# EAGLE design CARLA_PCB_v1_0 (EAGLE 9.4.2)
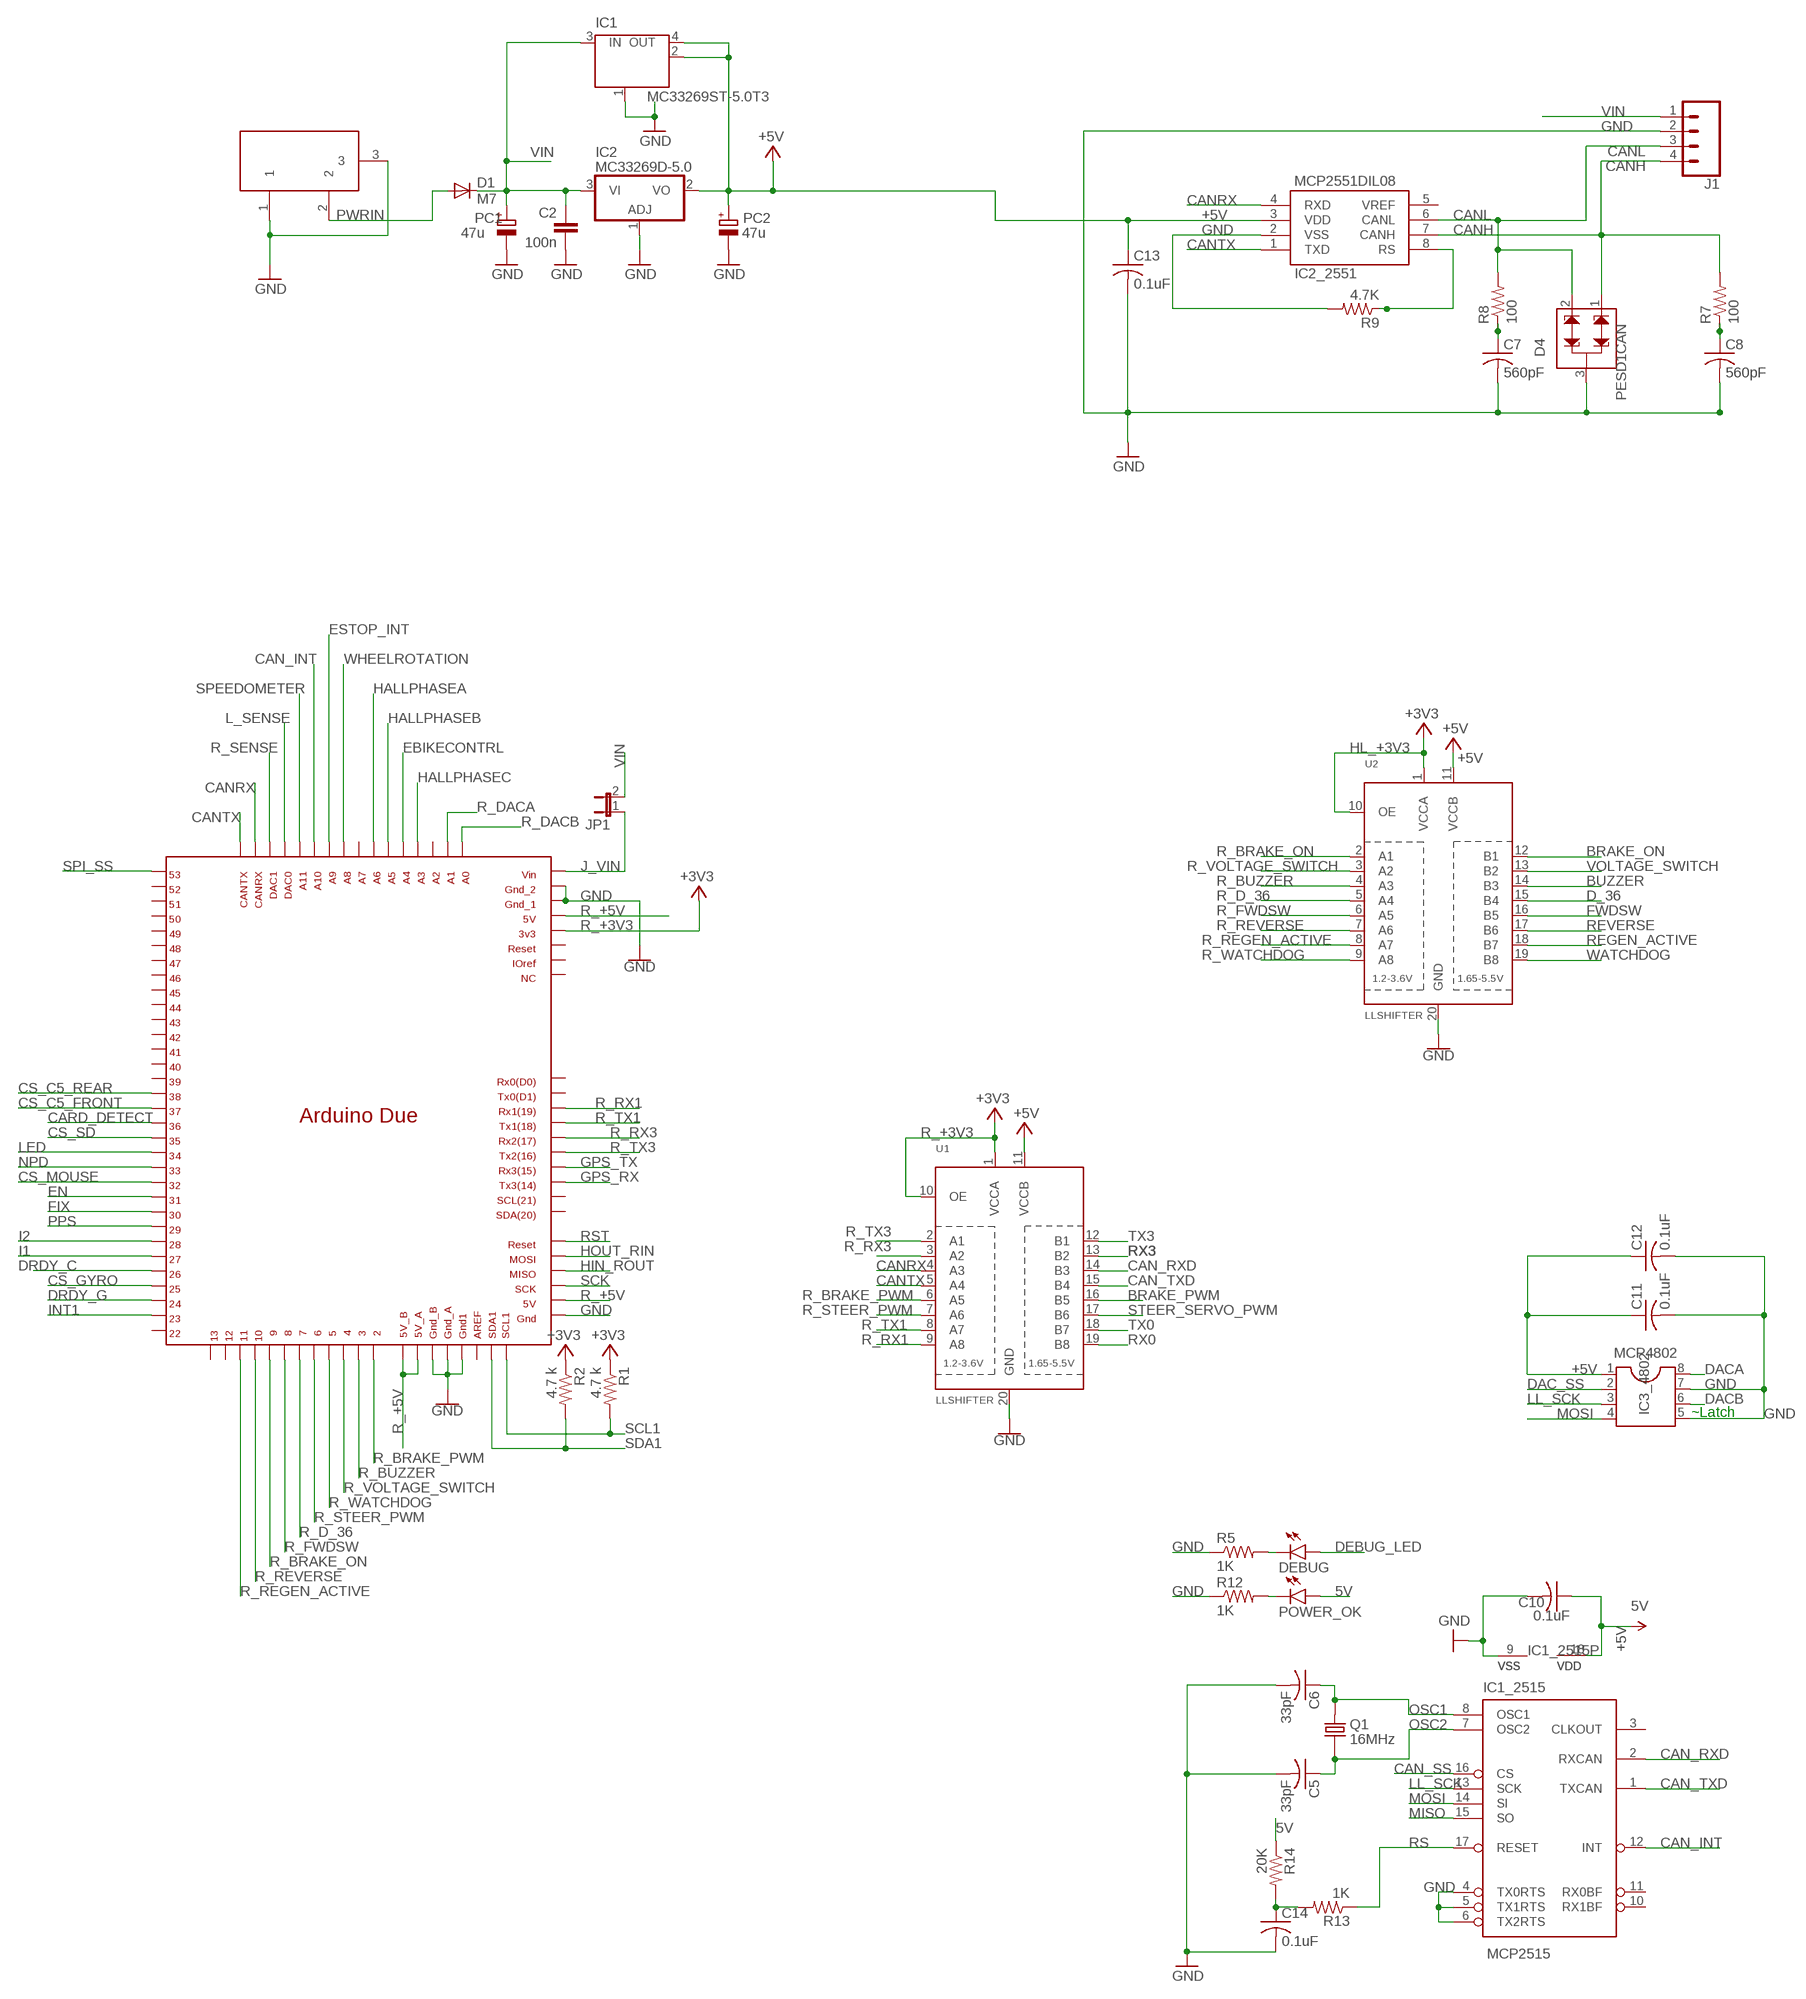
[diagram p0: schematic, sheet 1, part 1 of 2]
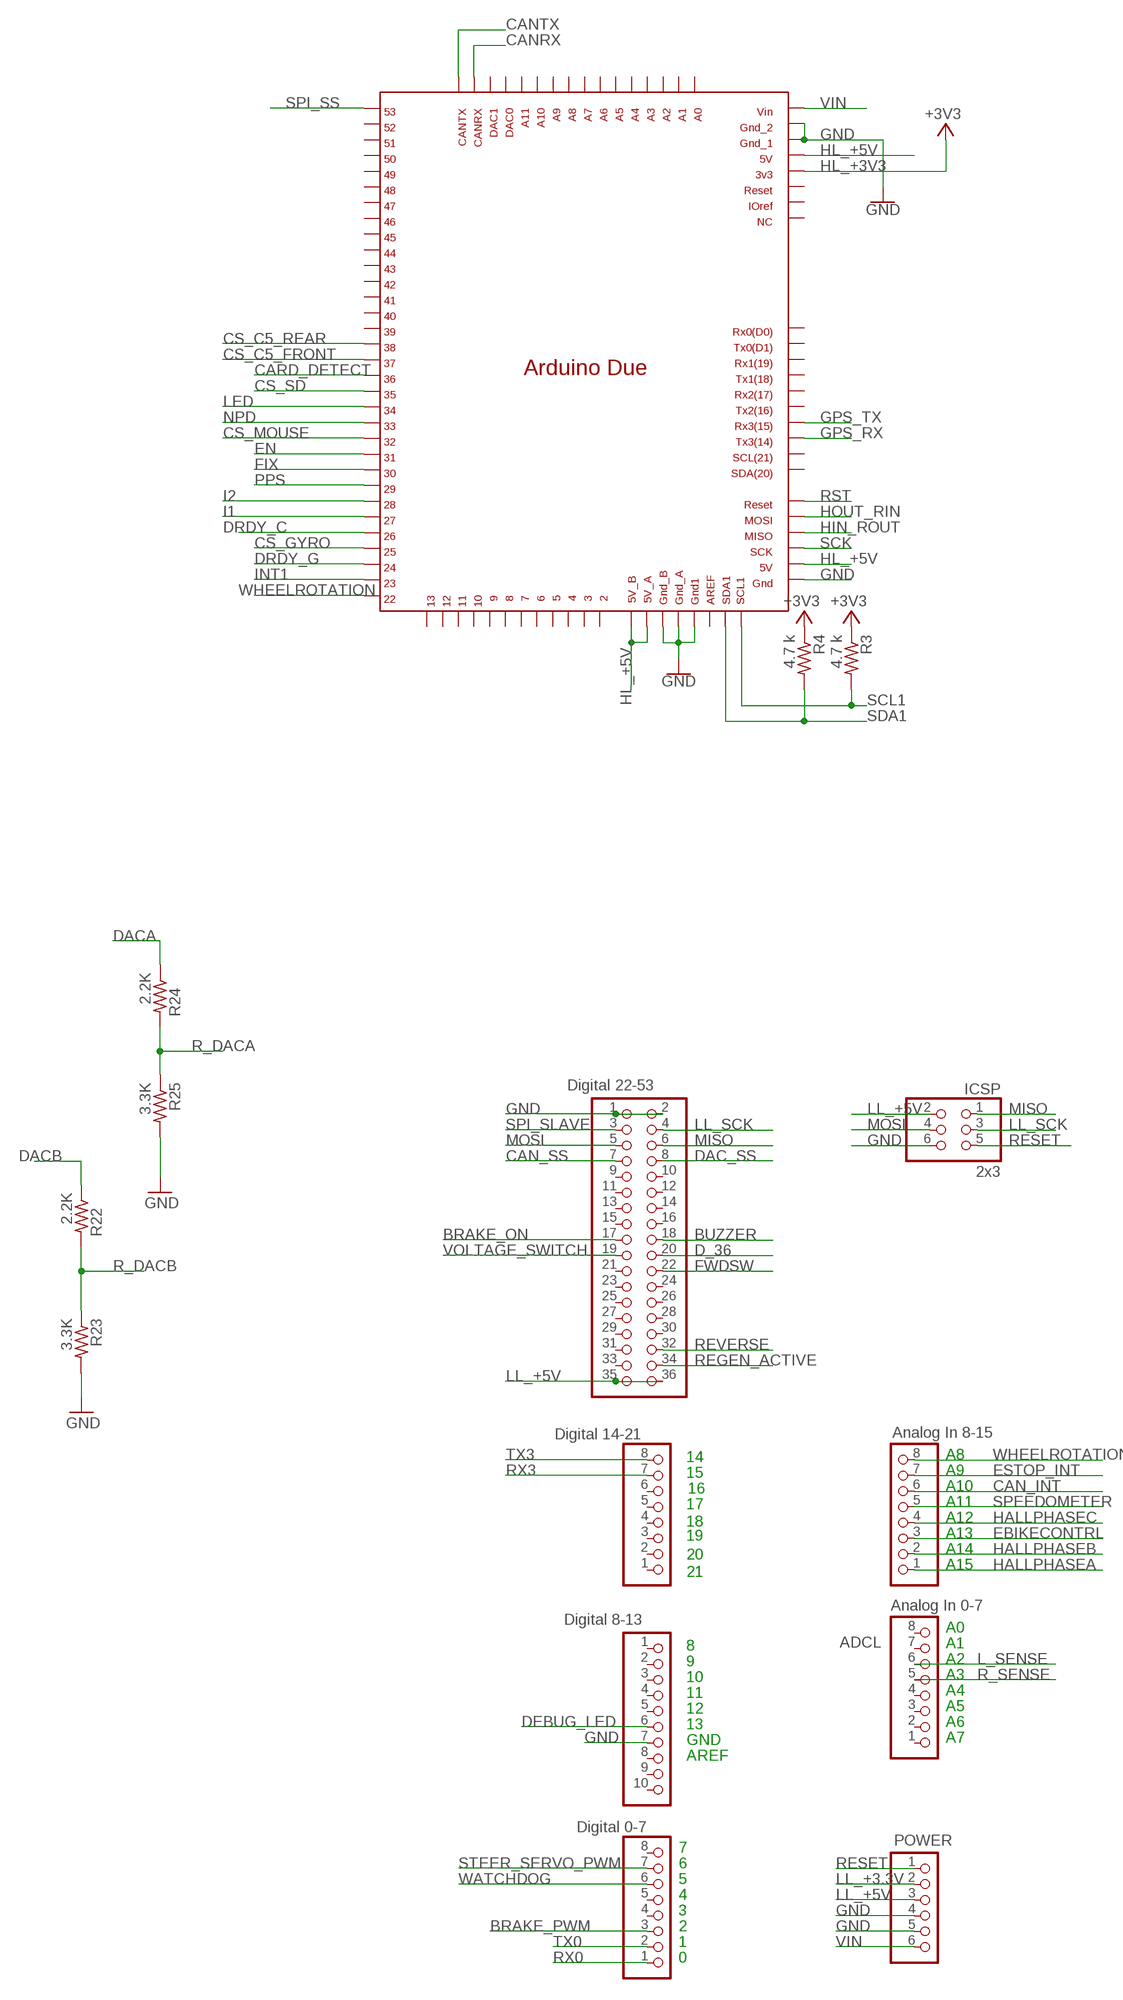
[diagram p1: schematic, sheet 1, part 2 of 2]

## Parts
ADCH  Analog In 8-15  PINHD-1X8  [1X08]
ADCL  Analog In 0-7  PINHD-1X8  [1X08]
C2  100n  C-EU0603-RND  [C0603-ROUND]
C5  33pF  C-USC1206  [C1206]
C6  33pF  C-USC1206  [C1206]
C7  560pF  C-USC1206  [C1206]
C8  560pF  C-USC1206  [C1206]
C10  0.1uF  C-USC1206  [C1206]
C11  0.1uF  C-USC1206  [C1206]
C12  0.1uF  C-USC1206  [C1206]
C13  0.1uF  C-USC1206  [C1206]
C14  0.1uF  C-USC1206  [C1206]
D1  M7  DIODE-SMB  [SMB]
D4  PESD1CAN  [SPARKFUN-DISCRETESEMI_SOT23-3]
DEBUG  LED3MM  [LED3MM]
DIGITAL_0-7  Digital 0-7  PINHD-1X8  [1X08]
DIGITAL_8-13  Digital 8-13  PINHD-1X10  [1X10]
DIGITAL_14-21  Digital 14-21  PINHD-1X8  [1X08]
IC1  MC33269ST-5.0T3  MC33269ST-3.3T3  [SOT223]
IC1_2515  MCP2515  MCP2515(MCP2510)P  [DIP18]
IC2  MC33269D-5.0  [DPACK]
IC2_2551  MCP2551DIL08  [IC-PACKAGE_DIL08]
IC3_4802  MCP4802  DIL8  [DIL08]
ICSP  2x3  PINHD-2X3  [2X03]
J1  CONN_04SCREW  [SCREWTERMINAL-3.5MM-4]
JP1  JP1E  [JP1]
MCU2  DUE(NORMAL)  [DUE(NORMAL)]
MCU3  DUE(NORMAL)  [DUE(NORMAL)]
MEGA_EXPANSION  Digital 22-53  PINHEAD_PINHD-2X18  [PINHEAD_2X18]
PC1  47u  CPOL-EUD  [PANASONIC_D]
PC2  47u  CPOL-EUD  [PANASONIC_D]
POWER  PINHD-1X6  [1X06]
POWER_OK  LED3MM  [LED3MM]
Q1  16MHz  ECS-160-20-46X  [XTAL_ECS-160-20-46X]
R1  4.7 k  R-US_0204/7  [0204/7]
R2  4.7 k  R-US_0204/7  [0204/7]
R3  4.7 k  R-US_0204/7  [0204/7]
R4  4.7 k  R-US_0204/7  [0204/7]
R5  1K  R-US_R1206  [R1206]
R7  100  R-US_R1206  [R1206]
R8  100  R-US_R1206  [R1206]
R9  4.7K  R-US_R1206  [R1206]
R12  1K  R-US_R1206  [R1206]
R13  1K  R-US_R1206  [R1206]
R14  20K  R-US_R1206  [R1206]
R22  2.2K  R-US_R1206  [R1206]
R23  3.3K  R-US_R1206  [R1206]
R24  2.2K  R-US_R1206  [R1206]
R25  3.3K  R-US_R1206  [R1206]
U1  LLSHIFTER  ELSHIFTER  [ELSHIFTER]
U2  LLSHIFTER  ELSHIFTER  [ELSHIFTER]
X1  DC21MMX  [DC-21MM]

## Nets
5V [Power]: POWER_OK.A R14.1
+3V3 [Power]: R1.1 R2.1 R3.1 R4.1
+5V [Power]: C10.1 C11.1 C12.1 C13.1 IC1.2(OUT) IC1.4(OUT) IC1_2515.18(VDD) IC2.2(VO) IC2_2551.3(VDD) IC3_4802.1 PC2.+ U1.11(VCCB) U2.11(VCCB) ; supply symbol labelled 5V
BRAKE_ON: MEGA_EXPANSION.17 U2.12(B1)
BRAKE_PWM: DIGITAL_0-7.3 U1.16(B5)
BUZZER: MEGA_EXPANSION.18 U2.14(B3)
CAN_INT: ADCH.6 IC1_2515.12(INT) MCU2.A10
CAN_RXD: IC1_2515.2(RXCAN) U1.14(B3)
CAN_SS [SPI_Signals]: IC1_2515.16(CS) MEGA_EXPANSION.7
CAN_TXD: IC1_2515.1(TXCAN) U1.15(B4)
CANH: D4.1 IC2_2551.7(CANH) J1.4 R7.2
CANL: D4.2 IC2_2551.6(CANL) J1.3 R8.2
CANRX: IC2_2551.4(RXD) MCU2.CANRX MCU3.CANRX U1.4(A3)
CANTX: IC2_2551.1(TXD) MCU2.CANTX MCU3.CANTX U1.5(A4)
CARD_DETECT: MCU2.36 MCU3.36
CS_C5_FRONT: MCU2.37 MCU3.37
CS_C5_REAR: MCU2.38 MCU3.38
CS_GYRO: MCU2.25 MCU3.25
CS_MOUSE: MCU2.32 MCU3.32
CS_SD: MCU2.35 MCU3.35
D_36: MEGA_EXPANSION.20 U2.15(B4)
DAC_SS [SPI_Signals]: IC3_4802.2 MEGA_EXPANSION.8
DACA: IC3_4802.8 R24.1
DACB: IC3_4802.6 R22.1
DEBUG_LED: DEBUG.A DIGITAL_8-13.6
DRDY_C: MCU2.26 MCU3.26
DRDY_G: MCU2.24 MCU3.24
EBIKECONTRL: ADCH.3 MCU2.A4
EN: MCU2.31 MCU3.31
ESTOP_INT: ADCH.7 MCU2.A9
FIX: MCU2.30 MCU3.30
FWDSW: MEGA_EXPANSION.22 U2.16(B5)
GND: C2.2 C5.2 C6.2 C7.2 C8.2 C10.2 C11.2 C12.2 C13.2 C14.2 D4.3 DIGITAL_8-13.7 IC1.1(GND/ADJ) IC1_2515.4(TX0RTS) IC1_2515.5(TX1RTS) IC1_2515.6(TX2RTS) IC1_2515.9(VSS) IC2.1(ADJ) IC2_2551.2(VSS) IC3_4802.5 IC3_4802.7 ICSP.6 J1.2 MCU2.5V_ICSP MCU2.GND1 MCU2.GND_1 MCU2.GND_2 MCU2.GND_A MCU2.GND_B MCU3.5V_ICSP MCU3.GND1 MCU3.GND_1 MCU3.GND_2 MCU3.GND_A MCU3.GND_B MEGA_EXPANSION.1 MEGA_EXPANSION.2 PC1.- PC2.- POWER.4 POWER.5 R5.1 R9.2 R12.1 R23.2 R25.2 U1.20(GND) U2.20(GND) X1.1 X1.3
GPS_RX: MCU2.TX3 MCU3.TX3
GPS_TX: MCU2.RX3 MCU3.RX3
HALLPHASEA: ADCH.1 MCU2.A6
HALLPHASEB: ADCH.2 MCU2.A5
HALLPHASEC: ADCH.4 MCU2.A3
HIN_ROUT: MCU2.MISO_ICSP MCU3.MISO_ICSP
HL_+3V3 [Power]: MCU3.3V3 U2.1(VCCA) U2.10(OE) ; supply symbol labelled +3V3
HL_+5V [Power]: MCU3.5V MCU3.5V_A MCU3.5V_B MCU3.GND_ICSP
HOUT_RIN: MCU2.MOSI_ICSP MCU3.MOSI_ICSP
I1: MCU2.27 MCU3.27
I2: MCU2.28 MCU3.28
INT1: MCU2.23 MCU3.23
J_VIN [Power]: JP1.1 MCU2.VIN
L_SENSE: ADCL.6 MCU2.DAC0
LED: MCU2.34 MCU3.34
LL_+3.3V [Power]: POWER.2
LL_+5V [Power]: ICSP.2 MEGA_EXPANSION.35 MEGA_EXPANSION.36 POWER.3
LL_SCK: IC1_2515.13(SCK) IC3_4802.3 ICSP.3 MEGA_EXPANSION.4
MISO: IC1_2515.15(SO) ICSP.1 MEGA_EXPANSION.6
MOSI: IC1_2515.14(SI) IC3_4802.4 ICSP.4 MEGA_EXPANSION.5
N$4: C14.1 R13.2 R14.2
N$9: C7.1 R8.1
N$10: C8.1 R7.1
N$12: POWER_OK.K(C) R12.2
N$13: DEBUG.K(C) R5.2
N$14: IC2_2551.8(RS) R9.1
NPD: MCU2.33 MCU3.33
OSC1 [Oscillator]: C6.1 IC1_2515.8(OSC1) Q1.2
OSC2 [Oscillator]: C5.1 IC1_2515.7(OSC2) Q1.1
PPS: MCU2.29 MCU3.29
PWRIN: D1.A X1.2
R_+3V3 [Power]: MCU2.3V3 U1.1(VCCA) U1.10(OE) ; supply symbol labelled +3V3
R_+5V [Power]: MCU2.5V MCU2.5V_A MCU2.5V_B MCU2.GND_ICSP
R_BRAKE_ON: MCU2.9 U2.2(A1)
R_BRAKE_PWM: MCU2.2 U1.6(A5)
R_BUZZER: MCU2.3 U2.4(A3)
R_D_36: MCU2.7 U2.5(A4)
R_DACA: MCU2.A1 R24.2 R25.1
R_DACB: MCU2.A0 R22.2 R23.1
R_FWDSW: MCU2.8 U2.6(A5)
R_REGEN_ACTIVE: MCU2.11 U2.8(A7)
R_REVERSE: MCU2.10 U2.7(A6)
R_RX1: MCU2.RX1 U1.9(A8)
R_RX3: MCU2.RX2 U1.3(A2)
R_SENSE: ADCL.5 MCU2.DAC1
R_STEER_PWM: MCU2.6 U1.7(A6)
R_TX1: MCU2.TX1 U1.8(A7)
R_TX3: MCU2.TX2 U1.2(A1)
R_VOLTAGE_SWITCH: MCU2.4 U2.3(A2)
R_WATCHDOG: MCU2.5 U2.9(A8)
REGEN_ACTIVE: MEGA_EXPANSION.34 U2.18(B7)
RESET: ICSP.5 POWER.1
REVERSE: MEGA_EXPANSION.32 U2.17(B6)
RS: IC1_2515.17(RESET) R13.1
RST: MCU2.RESET_ICSP MCU3.RESET_ICSP
RX0: DIGITAL_0-7.1 U1.19(B8)
RX3: DIGITAL_14-21.7 U1.13(B2)
SCK: MCU2.SCK_ICSP MCU3.SCK_ICSP
SCL1: MCU2.SCL1 MCU3.SCL1 R1.2 R3.2
SDA1: MCU2.SDA1 MCU3.SDA1 R2.2 R4.2
SPEEDOMETER: ADCH.5 MCU2.A11
SPI_SLAVE [SPI_Signals]: MEGA_EXPANSION.3
SPI_SS: MCU2.53 MCU3.53
STEER_SERVO_PWM: DIGITAL_0-7.7 U1.17(B6)
TX0: DIGITAL_0-7.2 U1.18(B7)
TX3: DIGITAL_14-21.8 U1.12(B1)
VIN [Power]: C2.1 D1.C IC1.3(IN) IC2.3(VI) J1.1 JP1.2 MCU3.VIN PC1.+ POWER.6
VOLTAGE_SWITCH: MEGA_EXPANSION.19 U2.13(B2)
WATCHDOG: DIGITAL_0-7.6 U2.19(B8)
WHEELROTATION: ADCH.8 MCU2.A8 MCU3.22
Unconnected: ADCL.1 ADCL.2 ADCL.3 ADCL.4 ADCL.7 ADCL.8 DIGITAL_0-7.4 DIGITAL_0-7.5 DIGITAL_0-7.8 DIGITAL_8-13.1 DIGITAL_8-13.2 DIGITAL_8-13.3 DIGITAL_8-13.4 DIGITAL_8-13.5 DIGITAL_8-13.8 DIGITAL_8-13.9 DIGITAL_8-13.10 DIGITAL_14-21.1 DIGITAL_14-21.2 DIGITAL_14-21.3 DIGITAL_14-21.4 DIGITAL_14-21.5 DIGITAL_14-21.6 IC1_2515.3(CLKOUT) IC1_2515.10(RX1BF) IC1_2515.11(RX0BF) IC2_2551.5(VREF) MCU2.12 MCU2.13 MCU2.22 MCU2.39 MCU2.40 MCU2.41 MCU2.42 MCU2.43 MCU2.44 MCU2.45 MCU2.46 MCU2.47 MCU2.48 MCU2.49 MCU2.50 MCU2.51 MCU2.52 MCU2.A2 MCU2.A7 MCU2.AREF MCU2.IOREF MCU2.NC MCU2.RESET MCU2.RX0 MCU2.SCL MCU2.SDA MCU2.TX0 MCU3.2 MCU3.3 MCU3.4 MCU3.5 MCU3.6 MCU3.7 MCU3.8 MCU3.9 MCU3.10 MCU3.11 MCU3.12 MCU3.13 MCU3.39 MCU3.40 MCU3.41 MCU3.42 MCU3.43 MCU3.44 MCU3.45 MCU3.46 MCU3.47 MCU3.48 MCU3.49 MCU3.50 MCU3.51 MCU3.52 MCU3.A0 MCU3.A1 MCU3.A2 MCU3.A3 MCU3.A4 MCU3.A5 MCU3.A6 MCU3.A7 MCU3.A8 MCU3.A9 MCU3.A10 MCU3.A11 MCU3.AREF MCU3.DAC0 MCU3.DAC1 MCU3.IOREF MCU3.NC MCU3.RESET MCU3.RX0 MCU3.RX1 MCU3.RX2 MCU3.SCL MCU3.SDA MCU3.TX0 MCU3.TX1 MCU3.TX2 MEGA_EXPANSION.9 MEGA_EXPANSION.10 MEGA_EXPANSION.11 MEGA_EXPANSION.12 MEGA_EXPANSION.13 MEGA_EXPANSION.14 MEGA_EXPANSION.15 MEGA_EXPANSION.16 MEGA_EXPANSION.21 MEGA_EXPANSION.23 MEGA_EXPANSION.24 MEGA_EXPANSION.25 MEGA_EXPANSION.26 MEGA_EXPANSION.27 MEGA_EXPANSION.28 MEGA_EXPANSION.29 MEGA_EXPANSION.30 MEGA_EXPANSION.31 MEGA_EXPANSION.33

## Notes on the sheet
- ~Latch
- 14 | A8
- 15 | A9
- 16 | A10
- 17 | A11
- 18 | A12
- 19 | A13
- A14
- 20
- A15
- 21
- A0
- 8 | A1
- 9 | A2
- 10 | A3
- 11 | A4
- 12 | A5
- 13 | A6
- GND | A7
- AREF
- 7
- 6
- 5
- 4
- 3
- 2
- 1
- 0

## Library data of the parts
ADCH ADCL DIGITAL_0-7 DIGITAL_14-21 = pinhead:PINHD-1X8: PIN HEADER
C2 = SmartPrj:C-EU: CAPACITOR, European symbol
C5-C8 C10-C14 = resistor:C-US: CAPACITOR, American symbol
D1 = diode:DIODE-: DIODE
D4 = elcanoParts:PESD1CAN: CAN bus ESD protection diode PESD1CAN is used to protect two CAN bus lines from ESD. Link to datasheet <http://www.nxp.com/documents/data_sheet/PESD1CAN-U.pdf> SparkFun Products: SparkFun CAN-BUS Shield <https://www.sparkfun.com/products/13262> '; SPICEPREFIX: J
DEBUG POWER_OK = led:LED: LED OSRAM: - CHIPLED LG R971, LG N971, LY N971, LG Q971, LY Q971, LO R971, LY R971 LH N974, LH R974 LS Q976, LO Q976, LY Q976 LO Q996 - Hyper CHIPLED LW Q18S LB Q993, LB Q99A, LB R99A - SideLED LS A670, LO A670, LY A670, LG A670, LP A670 LB A673, LV A673, LT A673, LW A673 LH A674 LY A675 LS A676, LA A676, LO A676, LY A676, LW A676 LS A679, LY A679, LG A679 - Hyper Micro SIDELED® LS Y876, LA Y876, LO Y876, LY Y876 LT Y87S - SmartLED LW L88C, LW L88S LB L89C, LB L89S, LG L890 LS L89K, LO L89K, LY L89K LS L896, LA L896, LO L896, LY L896 - TOPLED LS T670, LO T670, LY T670, LG T670, LP T670 LSG T670, LSP T670, LSY T670, LOP T670, LYG T670 LG T671, LOG T671, LSG T671 LB T673, LV T673, LT T673, LW T673 LH T674 LS T676, LA T676, LO T676, LY T676, LB T676, LH T676, LSB T676, LW T676 LB T67C, LV T67C, LT T67C, LS T67K, LO T67K, LY T67K, LW E67C LS E67B, LA E67B, LO E67B, LY E67B, LB E67C, LV E67C, LT E67C LW T67C LS T679, LY T679, LG T679 LS T770, LO T770, LY T770, LG T770, LP T770 LB T773, LV T773, LT T773, LW T773 LH T774 LS E675, LA E675, LY E675, LS T675 LS T776, LA T776, LO T776, LY T776, LB T776 LHGB T686 LT T68C, LB T68C - Hyper Mini TOPLED® LB M676 - Mini TOPLED Santana® LG M470 LS M47K, LO M47K, LY M47K Source: http://www.osram.convergy.de LUXEON: - LUMILED® LXK2-PW12-R00, LXK2-PW12-S00, LXK2-PW14-U00, LXK2-PW14-V00 LXK2-PM12-R00, LXK2-PM12-S00, LXK2-PM14-U00 LXK2-PE12-Q00, LXK2-PE12-R00, LXK2-PE12-S00, LXK2-PE14-T00, LXK2-PE14-U00 LXK2-PB12-K00, LXK2-PB12-L00, LXK2-PB12-M00, LXK2-PB14-N00, LXK2-PB14-P00, LXK2-PB14-Q00 LXK2-PR12-L00, LXK2-PR12-M00, LXK2-PR14-Q00, LXK2-PR14-R00 LXK2-PD12-Q00, LXK2-PD12-R00, LXK2-PD12-S00 LXK2-PH12-R00, LXK2-PH12-S00 LXK2-PL12-P00, LXK2-PL12-Q00, LXK2-PL12-R00 Source: www.luxeon.com KINGBRIGHT: KA-3528ASYC Source: www.kingbright.com
DIGITAL_8-13 = pinhead:PINHD-1X10: PIN HEADER
IC1 = linear:MC33269ST*: Adjustable Output Low Dropout Voltage Regulator 800 mA Source: http://www.onsemi.com/pub/Collateral/MC33269-D.PDF
IC1_2515 = SparkFun-IC-Comms:MCP2515(MCP2510): CAN controller with SPI interface The MCP2515 controller supercedes the MCP2510 while addressing all errata associated with it. The two devices are pin compatible, either can be used with this device. 18-pin package SOIC Simple SPI interface to any MCU. One-shot mode ensures message transmission is attempted only once Databyte filtering Start-of-Frame (SOF) output Low-power CMOS Technology Datasheet <http://www.sparkfun.com/datasheets/DevTools/Arduino/MCP2515.pdf> SparkFun Products CAN-BUS Shield <https://www.sparkfun.com/products/13262> (DEV-13262); PROD_ID: NA-XXXXX; SPICEPREFIX: X
IC2 = linear:MC33269?*: Adjustable Output Low Dropout Voltage Regulator 800 mA Source: http://www.onsemi.com/pub/Collateral/MC33269-D.PDF
IC2_2551 = elcanoParts:MCP2551: CAN transceiver; SPICEPREFIX: X
IC3_4802 = ic-package:DIL8: Dual In Line / Socket
ICSP = pinhead:PINHD-2X3: PIN HEADER
J1 = SparkFun-Connectors:CONN_04: Multi connection point. Often used as Generic Header-pin footprint for 0.1 inch spaced/style header connections On any of the 0.1 inch spaced packages, you can populate with these: Break Away Headers - Straight <https://www.sparkfun.com/products/116> (PRT-00116) Break Away Male Headers - Right Angle <https://www.sparkfun.com/products/553> (PRT-00553) Female Headers <https://www.sparkfun.com/products/115> (PRT-00115) Break Away Headers - Machine Pin <https://www.sparkfun.com/products/117> (PRT-00117) Break Away Female Headers - Swiss Machine Pin <https://www.sparkfun.com/products/743> (PRT-00743) For SCREWTERMINALS and SPRING TERMINALS visit here: Screw Terimnals on SparkFun.com <https://www.sparkfun.com/search/results?term=Screw+Terminals> (5mm/3.5mm/2.54mm spacing) This device is also useful as a general connection point to wire up your design to another part of your project. Our various solder wires solder well into these plated through hole pads. Hook-Up Wire - Assortment (Stranded, 22 AWG) <https://www.sparkfun.com/products/11375> (PRT-11375) Hook-Up Wire - Assortment (Solid Core, 22 AWG) <https://www.sparkfun.com/products/11367> (PRT-11367) View the entire wire category on our website here <https://www.sparkfun.com/categories/141> Special notes: Molex polarized connector foot print use with SKU : PRT-08231 with associated crimp pins and housings. 1MM SMD Version SKU: PRT-10208; PROD_ID: 2xCONN-08399; SF_ID: 2xPRT-08084
JP1 = jumper:JP1E: JUMPER
MCU2 MCU3 = DUElib130425:DUE(NORMAL)
MEGA_EXPANSION = elcanoParts:PINHEAD_PINHD-2X18: PIN HEADER
PC1 PC2 = rcl:CPOL-EU: POLARIZED CAPACITOR, European symbol
POWER = pinhead:PINHD-1X6: PIN HEADER
Q1 = elcanoParts:ECS-160-20-46X: QUARTZ CRYSTAL T/H; DESCRIPTION: Crystal 16MHz ±30ppm _Tol_ ±50ppm _Stability_ 20pF FUND 50Ohm; DIGI-KEY_PART_NUMBER: XC1759-ND; DIGI-KEY_PURCHASE_URL: https://www.digikey.com/product-detail/en/ecs-inc/ECS-160-20-46X/XC1759-ND/2676589?utm_source=snapeda&utm_medium=aggregator&utm_campaign=symbol; MF: ECS Inc.; MP: ECS-160-20-46X; PACKAGE: HC46/X ECS International; SPICEPREFIX: B
R1-R5 R7-R9 R12-R14 R22-R25 = resistor:R-US_: RESISTOR, American symbol
U1 U2 = ELCano_Footprints:ELSHIFTER: TXB0108 LEVEL SHIFTER. Foot Print for adafruit breakout board.
X1 = powersupply:DC21MM

## Net classes
0 default: width 0.254 mm, drill 0.305 mm, clearance 0.254 mm
1 Power: width 0.508 mm, drill 0.305 mm, clearance 0.254 mm
3 SPI_Signals: width 0.254 mm, clearance 0.254 mm
4 Oscillator: width 0.254 mm, clearance 0.508 mm

## Board
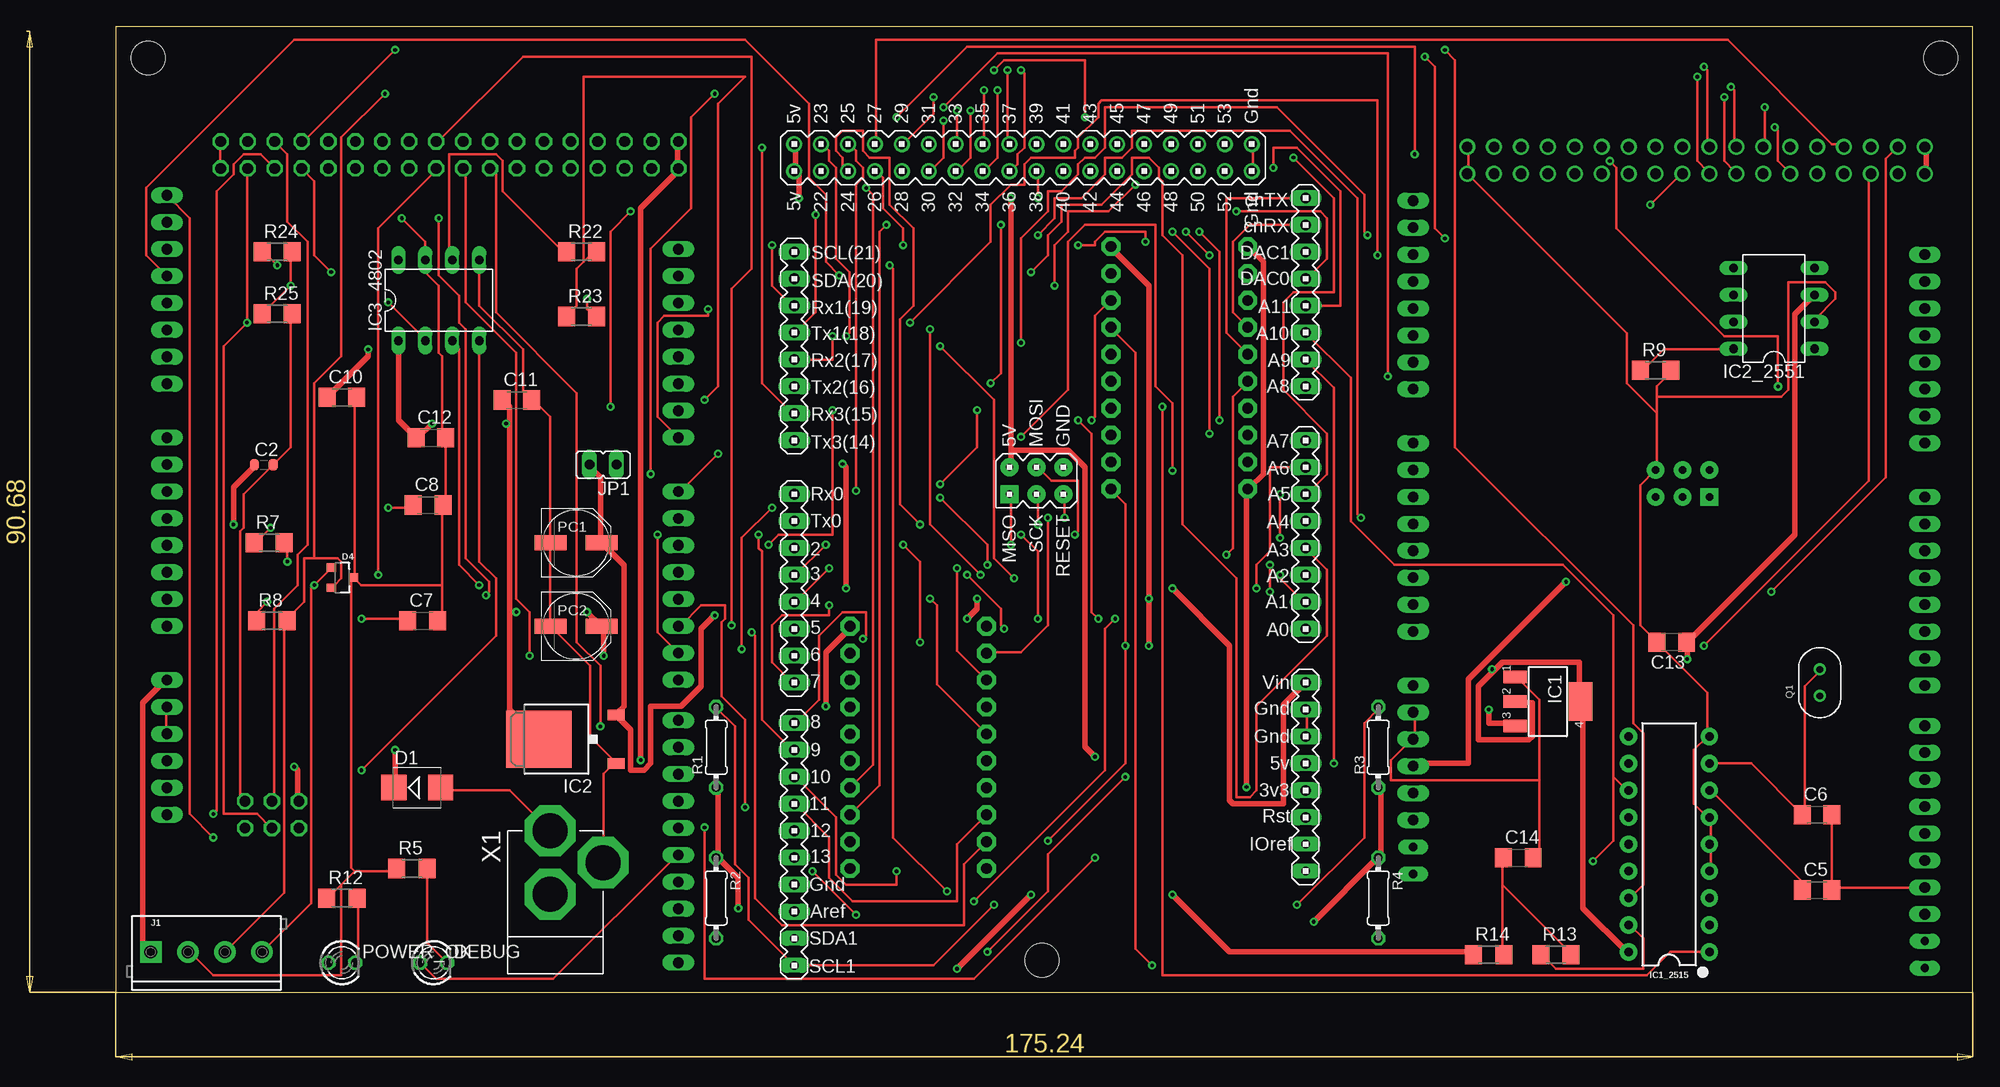
[diagram p2: board, top side]
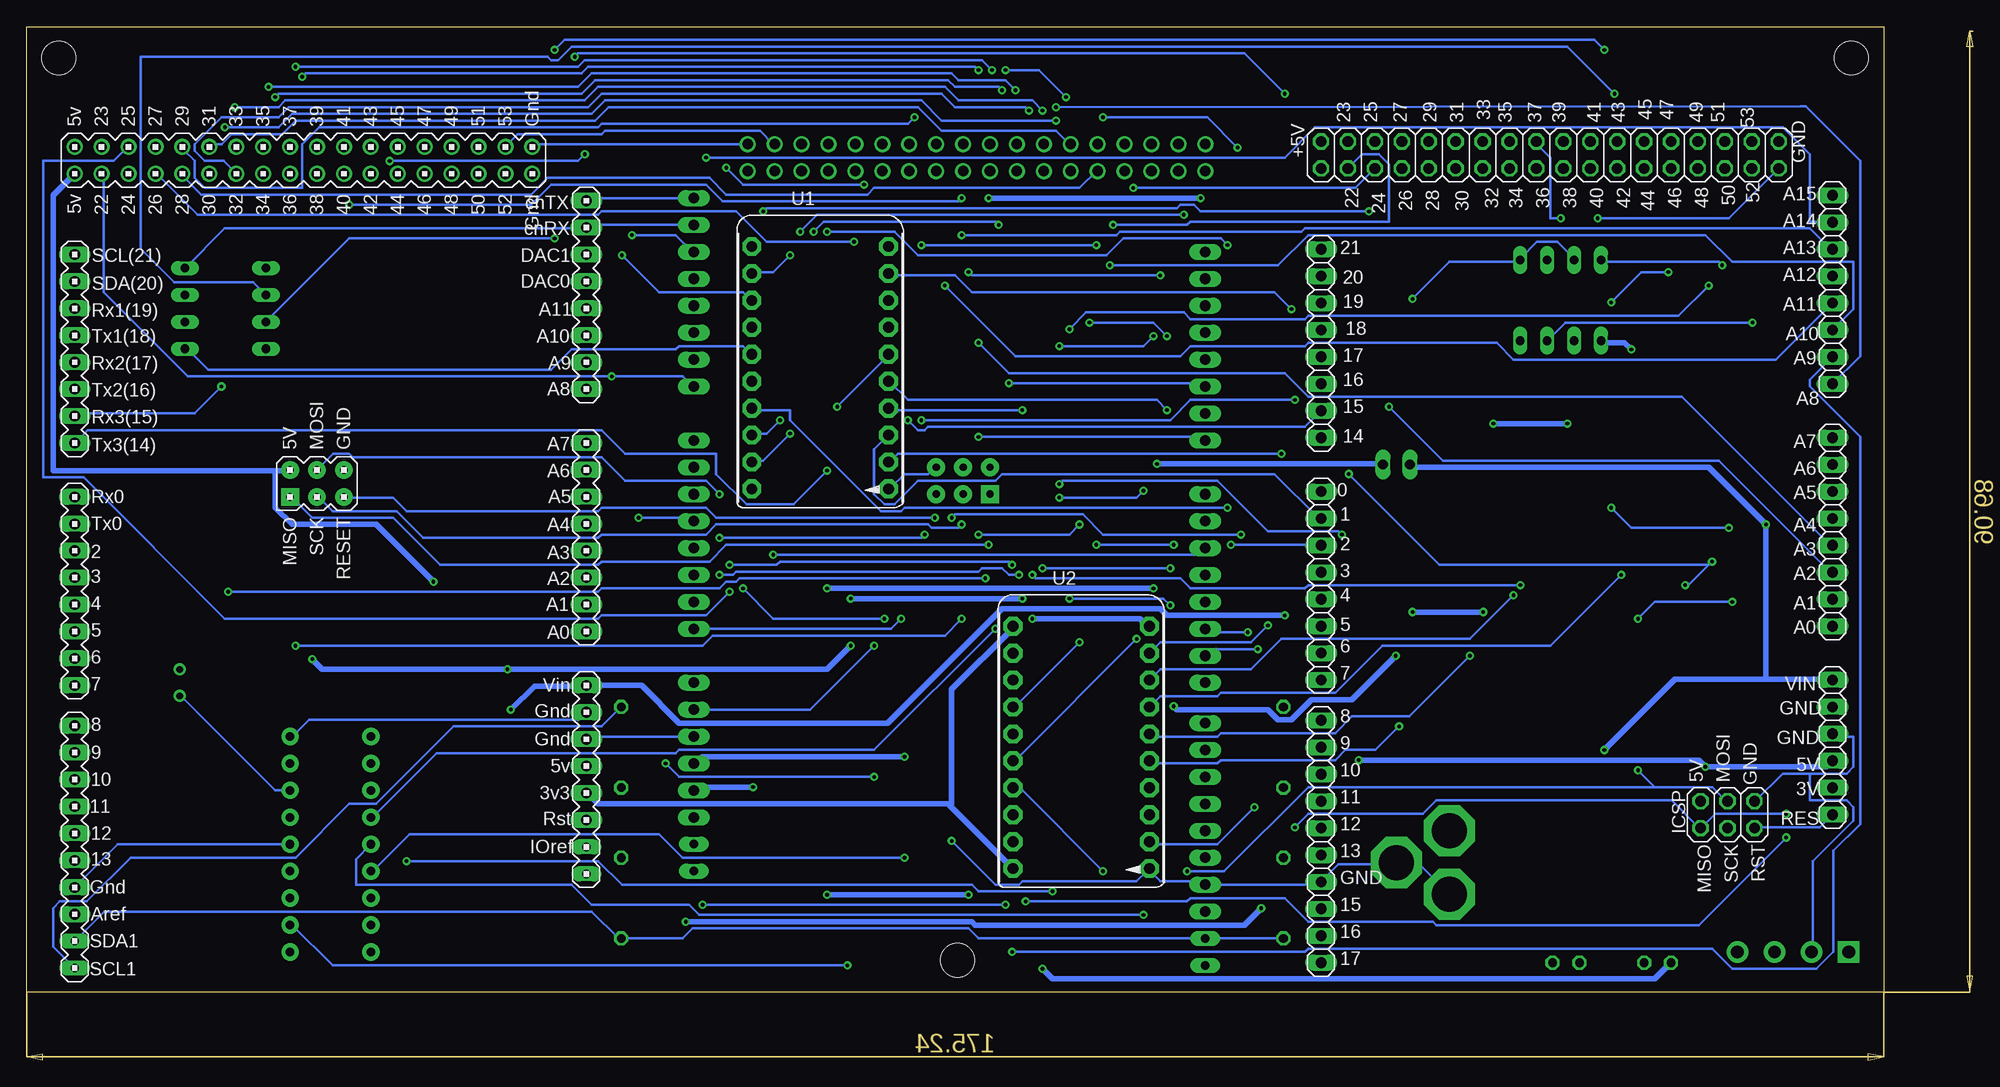
[diagram p3: board, bottom side, seen from below]

Size 175.24 x 91.11 mm. Coordinates in mm from the lower left corner, seen from the top.
Outline: 0,0 175.24,0 175.24,91.11 0,91.11 0,0
Copper layers (1*16): Top 0.035mm / dielectric 1.5mm / Bottom 0.035mm
Design rules "default": minimum track width 6mil, minimum drill 0.35mm, track to track 6mil, track to pad 6mil, pad to pad 6mil, via to via 6mil, smd to smd 6mil, copper to edge 40mil, drill to drill 6mil, minimum pad ring 10mil, minimum via ring 8mil, stop-mask expansion 4mil, vias tented up to drill 0mil, thermal gap 10mil
Holes 3.2 mm at 3.05,88.14 172.21,88.14 87.38,3.05

### Footprints (pad centres in the part's own frame; a part is rotated, then mirrored left to right if it is on the bottom)
1X08 = drill 1.016 long: 1 -8.89,0; 2 -6.35,0; 3 -3.81,0; 4 -1.27,0; 5 1.27,0; 6 3.81,0; 7 6.35,0; 8 8.89,0
C0603-ROUND = smd 0.898 x 1.1: 1 -0.889,0; 2 0.889,0
C1206 = smd 1.6 x 1.8: 1 -1.4,0; 2 1.4,0
SMB = smd 2.4 x 2.4: A 2.2,0; C -2.2,0
SPARKFUN-DISCRETESEMI_SOT23-3 = smd 0.8 x 0.9: 1 -0.95,-1; 2 0.95,-1; 3 0,1.1
LED3MM = drill 0.813 octagon: A -1.27,0; K 1.27,0
1X10 = drill 1.016 long: 1 -11.43,0; 2 -8.89,0; 3 -6.35,0; 4 -3.81,0; 5 -1.27,0; 6 1.27,0; 7 3.81,0; 8 6.35,0; 9 8.89,0; 10 11.43,0
SOT223 = smd 1.219 x 2.235: 1 -2.311,-3.099; 2 0,-3.099; 3 2.311,-3.099 | smd 3.6 x 2.2: 4 0,3.099
DIP18 = drill 0.813 pad 1.626: 1 -10.16,-3.81; 2 -7.62,-3.81; 3 -5.08,-3.81; 4 -2.54,-3.81; 5 0,-3.81; 6 2.54,-3.81; 7 5.08,-3.81; 8 7.62,-3.81; 9 10.16,-3.81; 10 10.16,3.81; 11 7.62,3.81; 12 5.08,3.81; 13 2.54,3.81; 14 0,3.81; 15 -2.54,3.81; 16 -5.08,3.81; 17 -7.62,3.81; 18 -10.16,3.81
DPACK = smd 1 x 1.6: 1 -2.28,-4.8; 3 2.28,-4.8 | smd 5.4 x 6.2: 2 0,2.5
IC-PACKAGE_DIL08 = drill 0.813 long: 1 -3.81,-3.81; 2 -1.27,-3.81; 3 1.27,-3.81; 4 3.81,-3.81; 5 3.81,3.81; 6 1.27,3.81; 7 -1.27,3.81; 8 -3.81,3.81
DIL08 = drill 0.813 long: 1 -3.81,-3.81; 2 -1.27,-3.81; 3 1.27,-3.81; 4 3.81,-3.81; 5 3.81,3.81; 6 1.27,3.81; 7 -1.27,3.81; 8 -3.81,3.81
2X03 = drill 1.016 octagon: 1 -2.54,-1.27; 2 -2.54,1.27; 3 0,-1.27; 4 0,1.27; 5 2.54,-1.27; 6 2.54,1.27
SCREWTERMINAL-3.5MM-4 = drill 1.2 pad 2.032 square: 1 0,0 | drill 1.2 pad 2.032: 2 3.5,0; 3 7,0; 4 10.5,0
JP1 = drill 0.914 long: 1 0,-1.27; 2 0,1.27
DUE(NORMAL) = drill 1 long: 2 -16.51,30.48; 3 -19.05,30.48; 3V3 -39.37,-17.78; 4 -21.59,30.48; 5 -24.13,30.48; 5V -36.83,-17.78; 6 -26.67,30.48; 7 -29.21,30.48; 8 -33.02,30.48; 9 -35.56,30.48; 10 -38.1,30.48; 11 -40.64,30.48; 12 -43.18,30.48; 13 -45.72,30.48; A0 -24.13,-17.78; A1 -21.59,-17.78; A2 -19.05,-17.78; A3 -16.51,-17.78; A4 -13.97,-17.78; A5 -11.43,-17.78; A6 -8.89,-17.78; A7 -6.35,-17.78; A8 -1.27,-17.78; A9 1.27,-17.78; A10 3.81,-17.78; A11 6.35,-17.78; AREF -50.8,30.48; CANRX 13.97,-17.78; CANTX 16.51,-17.78; DAC0 8.89,-17.78; DAC1 11.43,-17.78; GND1 -48.26,30.48; GND_1 -34.29,-17.78; GND_2 -31.75,-17.78; RESET -41.91,-17.78; RX0 -11.43,30.48; RX1 6.35,30.48; RX2 1.27,30.48; RX3 -3.81,30.48; SCL 11.43,30.48; SDA 8.89,30.48; TX0 -13.97,30.48; TX1 3.81,30.48; TX2 -1.27,30.48; TX3 -6.35,30.48; VIN -29.21,-17.78 | drill 1: 5V_A 19.05,30.48; 5V_B 21.59,30.48; 22 19.05,27.94; 23 21.59,27.94; 24 19.05,25.4; 25 21.59,25.4; 26 19.05,22.86; 27 21.59,22.86; 28 19.05,20.32; 29 21.59,20.32; 30 19.05,17.78; 31 21.59,17.78; 32 19.05,15.24; 33 21.59,15.24; 34 19.05,12.7; 35 21.59,12.7; 36 19.05,10.16; 37 21.59,10.16; 38 19.05,7.62; 39 21.59,7.62; 40 19.05,5.08; 41 21.59,5.08; 42 19.05,2.54; 43 21.59,2.54; 44 19.05,0; 45 21.59,0; 46 19.05,-2.54; 47 21.59,-2.54; 48 19.05,-5.08; 49 21.59,-5.08; 50 19.05,-7.62; 51 21.59,-7.62; 52 19.05,-10.16; 53 21.59,-10.16; GND_A 19.05,-12.7; GND_B 21.59,-12.7 | drill 0.7 pad 1.676: 5V_ICSP -8.89,5.08; GND_ICSP -8.89,10.16; MOSI_ICSP -8.89,7.62; RESET_ICSP -11.43,5.08; SCK_ICSP -11.43,7.62 | drill 0.8 pad 1.422 long: IOREF -44.45,-17.78; NC -46.99,-17.78; SCL1 -55.88,30.48; SDA1 -53.34,30.48 | drill 0.7 pad 1.676 square: MISO_ICSP -11.43,10.16
PINHEAD_2X18 = drill 1.016 octagon: 1 -21.59,-1.27; 2 -21.59,1.27; 3 -19.05,-1.27; 4 -19.05,1.27; 5 -16.51,-1.27; 6 -16.51,1.27; 7 -13.97,-1.27; 8 -13.97,1.27; 9 -11.43,-1.27; 10 -11.43,1.27; 11 -8.89,-1.27; 12 -8.89,1.27; 13 -6.35,-1.27; 14 -6.35,1.27; 15 -3.81,-1.27; 16 -3.81,1.27; 17 -1.27,-1.27; 18 -1.27,1.27; 19 1.27,-1.27; 20 1.27,1.27; 21 3.81,-1.27; 22 3.81,1.27; 23 6.35,-1.27; 24 6.35,1.27; 25 8.89,-1.27; 26 8.89,1.27; 27 11.43,-1.27; 28 11.43,1.27; 29 13.97,-1.27; 30 13.97,1.27; 31 16.51,-1.27; 32 16.51,1.27; 33 19.05,-1.27; 34 19.05,1.27; 35 21.59,-1.27; 36 21.59,1.27
PANASONIC_D = smd 3 x 1.4: + 2.4,0; - -2.4,0
1X06 = drill 1.016 long: 1 -6.35,0; 2 -3.81,0; 3 -1.27,0; 4 1.27,0; 5 3.81,0; 6 6.35,0
XTAL_ECS-160-20-46X = drill 0.63 pad 1.03: 1 -1.25,0; 2 1.25,0
0204/7 = drill 0.813 octagon: 1 -3.81,0; 2 3.81,0
R1206 = smd 1.6 x 1.803: 1 -1.422,0; 2 1.422,0
ELSHIFTER = drill 1.016 pad 1.778 octagon: 1 -5.2,24.63; 2 -5.2,22.09; 3 -5.2,19.55; 4 -5.2,17.01; 5 -5.2,14.47; 6 -5.2,11.93; 7 -5.2,9.39; 8 -5.2,6.85; 9 -5.2,4.31; 10 -5.2,1.77; 11 7.69,24.63; 12 7.69,22.09; 13 7.69,19.55; 14 7.69,17.01; 15 7.69,14.47; 16 7.69,11.93; 17 7.69,9.39; 18 7.69,6.85; 19 7.69,4.31; 20 7.69,1.77
DC-21MM = drill 3.302 pad 4.826 octagon: 1 -5.08,-3.353; 2 -0.076,-6.35; 3 -0.076,-0.356

### Placement (x,y rotation side)
ADCH  4.83,66.29 270 bottom
ADCL  4.83,43.43 270 bottom
C2  13.97,49.78 0 top
C5  160.53,9.65 0 top
C6  160.53,16.76 0 top
C7  28.96,35.05 0 top
C8  29.46,45.97 0 top
C10  21.34,56.13 0 top
C11  37.85,55.88 0 top
C12  29.72,52.32 0 top
C13  146.81,33.02 180 top
C14  132.33,12.7 0 top
D1  28.45,19.3 0 top
D4  21.34,39.12 270 top
DEBUG  29.97,2.79 0 top
DIGITAL_0-7  53.09,38.35 270 bottom
DIGITAL_8-13  53.09,14.22 270 bottom
DIGITAL_14-21  53.09,61.21 270 bottom
IC1  135.13,27.43 270 top
IC1_2515  146.56,13.97 90 top
IC2  42.42,23.88 90 top
IC2_2551  156.46,64.52 90 top
IC3_4802  30.48,65.28 0 top
ICSP  14.73,16.76 0 bottom
J1  3.3,3.81 0 top
JP1  45.97,49.78 90 top
MCU2  94.49,58.42 90 top
MCU3  140.21,58.17 90 bottom
MEGA_EXPANSION  31.5,78.99 180 bottom
PC1  43.43,42.42 0 top
PC2  43.43,34.54 0 top
POWER  4.83,23.11 90 bottom
POWER_OK  21.34,2.79 0 top
Q1  160.78,29.21 90 top
R1  56.64,23.11 90 top
R2  56.64,8.89 270 top
R3  119.13,23.11 90 top
R4  119.13,8.89 270 top
R5  27.94,11.68 0 top
R7  14.48,42.42 0 top
R8  14.73,35.05 0 top
R9  145.29,58.67 0 top
R12  21.34,8.89 0 top
R13  135.89,3.56 0 top
R14  129.54,3.56 0 top
R22  43.94,69.85 0 top
R23  43.94,63.75 0 top
R24  15.24,69.85 0 top
R25  15.24,64.01 0 top
U1  101.6,45.72 0 bottom
U2  76.96,9.91 0 bottom
X1  40.89,8.89 180 top

### Tracks (layer width: path | path; a pad name or v marks a point on that pad's centre or on a via)
5V  (via drill 0.35)
  Top 0.508: v79.38,2.22 v86.36,9.21 | R14.1 127.86,3.81 105.09,3.81 v99.69,9.21
  Bottom 0.508: v86.36,9.21 v99.69,9.21 | v79.38,2.22 78.42,1.27 21.59,1.27 POWER_OK.A
+3V3  (via drill 0.35)
  Top 0.508: 56.83,12.7 56.83,19.05 R1.1 | R3.1 119.38,19.05 119.38,12.7 R4.1 119.06,12.7 v113.03,6.67 | 56.83,12.7 58.74,10.79 v58.74,7.94 | 56.83,12.7 R2.1
  Bottom 0.508: v58.74,7.94 60.33,6.35 85.72,6.35 86.04,6.67 v113.03,6.67
+5V  (via drill 0.35)
  Top 0.508: IC3_4802.1 26.67,53.98 28.26,52.39 C12.1 28.57,52.39 v29.84,53.66 | v23.81,60.64 23.81,60.01 20,56.2 C10.1 | 37.15,35.88 37.15,26.67 39.69,24.13 IC2.2 | 37.15,35.88 37.15,53.66 | 37.15,53.66 37.15,55.24 36.51,55.88 C11.1 | v44.45,35.88 45.72,34.61 PC2.+ 46.04,34.29 v46.04,31.75 | 37.15,35.88 v37.78,35.88 | v66.99,26.99 66.99,32.07 69.22,34.29 U2.11 | 37.15,53.66 v36.83,53.66 | 148.27,33.02 158.43,43.18 158.43,63.94 IC2_2551.3 | 130.02,30.32 130.81,31.11 138.11,31.11 138.11,27.62 IC1.4 138.43,27.3 138.43,7.94 142.56,3.81 IC1_2515.18 | 130.02,30.32 128.59,28.89 128.59,23.81 133.35,23.81 133.67,24.13 133.67,27.3 132.08,27.3 IC1.2 | v97.47,32.7 v97.47,37.15 97.47,66.67 93.98,70.17 U1.11 | v129.86,30.48 130.02,30.32 | v148.27,31.43 148.27,33.02 | 148.27,33.02 C13.1 | v80.33,35.24 81.28,36.2 v81.28,37.15
  Bottom 0.508: v23.81,60.64 24.45,61.28 26.48,61.28 IC3_4802.1 | v37.78,35.88 v44.45,35.88 | v66.99,26.99 66.67,26.67 58.1,26.67 57.15,25.72 55.88,25.72 53.98,27.62 50.16,27.62 v46.04,31.75 | v36.83,53.66 v29.84,53.66 | v97.47,32.7 99.69,30.48 v129.86,30.48 147.32,30.48 v148.27,31.43 | v80.33,35.24 70.17,35.24 69.46,34.54 U2.11 | v97.47,37.15 v81.28,37.15
BRAKE_ON  (via drill 0.35)
  Top 0.254: v58.1,34.61 58.1,66.36 60.01,68.26 60.01,88.27 38.42,88.27 30.42,80.26 MEGA_EXPANSION.17
  Bottom 0.254: v58.1,34.61 59.69,33.02 68.26,33.02 69.22,32.07 U2.12
BRAKE_PWM  (via drill 0.35)
  Top 0.254: v61.59,42.23 62.55,43.18 67.63,43.18 v67.63,54.93
  Bottom 0.254: v61.59,42.23 53.34,42.23 DIGITAL_0-7.3 | v67.63,54.93 68.58,55.88 92.08,55.88 93.84,57.65 U1.16
BUZZER  (via drill 0.35)
  Top 0.254: v24.77,39.37 24.77,72.07 30.23,77.53 MEGA_EXPANSION.18
  Bottom 0.254: v24.77,39.37 31.43,32.7 47.31,32.7 51.75,28.26 62.55,28.26 62.87,27.94 68.26,27.94 69.22,26.99 U2.14
CAN_INT  (via drill 0.35)
  Top 0.254: 141.29,20.32 141.29,35.56 136.53,40.32 120.65,40.32 116.52,44.45 116.52,57.98 MCU2.A10 | 141.29,20.32 142.56,19.05 IC1_2515.12 | v73.03,68.58 73.34,68.26 73.34,14.61 v78.42,9.53 | v139.38,12.38 141.29,14.29 141.29,20.32
  Bottom 0.254: ADCH.6 2.86,64.45 2.86,68.9 14.29,68.9 16.83,71.44 54.29,71.44 57.15,68.58 v73.03,68.58 | v78.42,9.53 85.41,9.53 86.04,10.16 119.06,10.16 121.28,12.38 v139.38,12.38
CAN_RXD  (via drill 0.35)
  Top 0.254: v97.79,2.54 96.2,4.13 96.2,60.33 93.98,62.55 U1.14
  Bottom 0.254: v97.79,2.54 146.37,2.54 150.18,6.35 IC1_2515.2
CAN_SS  (via drill 0.35)
  Top 0.254: v26.35,88.9 17.78,80.33 MEGA_EXPANSION.7 | v125.41,88.9 126.36,87.95 126.36,51.44 143.19,34.61 143.19,25.4 144.15,24.45 144.15,10.16 142.88,8.89 IC1_2515.16
  Bottom 0.254: v26.35,88.9 27.3,89.85 124.46,89.85 v125.41,88.9
CAN_TXD  (via drill 0.35)
  Top 0.254: v98.74,55.24 98.74,1.59 144.46,1.59 146.69,3.81 IC1_2515.1
  Bottom 0.254: v98.74,55.24 93.98,60.01 U1.15
CANH  (via drill 0.35)
  Top 0.254: D4.1 20.32,40.01 v18.73,38.42 18.41,38.1 18.41,8.42 J1.4 | v16.19,40.64 16.19,42.23 R7.2 | v125.41,71.12 124.46,72.07 124.46,87.31 v123.51,88.27 | v56.52,84.77 54.29,82.55 54.29,73.98 50.48,70.17 v50.48,48.9
  Bottom 0.254: 16.51,40.32 18.41,38.42 v18.73,38.42 | 16.51,40.32 v16.19,40.64 | IC2_2551.7 144.78,71.12 v125.41,71.12 | v123.51,88.27 123.19,88.58 60.33,88.58 v56.52,84.77 | v50.48,48.9 41.91,40.32 16.51,40.32
CANL  (via drill 0.35)
  Top 0.254: 18.73,40.96 17.78,40.96 17.78,36.83 16.19,35.24 R8.2 15.88,34.77 15.88,9.38 J1.3 | 18.73,40.96 20.95,40.96 21.27,40.64 21.27,39.05 20.64,38.42 D4.2 | v25.4,84.77 21.27,80.64 21.27,60.01 18.73,57.47 18.73,40.96
  Bottom 0.254: v25.4,84.77 29.84,89.22 123.83,89.22 125.09,87.95 125.73,87.95 126.05,88.27 164.47,88.27 164.47,70.17 161.29,66.99 153.86,66.99 IC2_2551.6
CANRX
  Top 0.254: MCU2.CANRX 107,72.39 105.41,70.8 105.41,64.14 106.68,62.87 U1.4
  Bottom 0.254: IC2_2551.4 156.53,72.07 122.49,72.07 MCU3.CANRX 122.24,72.39 MCU2.CANRX
CANTX
  Top 0.254: MCU2.CANTX 104.78,74.93 104.78,62.23 106.68,60.33 U1.5
  Bottom 0.254: MCU2.CANTX 122.24,74.93 MCU3.CANTX | U1.5 106.86,60.19 107.63,60.96 113.67,60.96 113.98,60.64 123.83,60.64 125.73,58.74 158.12,58.74 160.08,60.71 IC2_2551.1
CARD_DETECT  (via drill 0.35)
  Top 0.254: v85.41,87 85.72,86.68 85.72,79.69 85.09,79.06 85.09,78.11 84.45,77.47 MCU2.36 | v149.22,86.36 149.22,78.42 150.18,77.47 MCU3.36
  Bottom 0.254: v85.41,87 85.72,87.31 122.24,87.31 122.87,86.68 148.91,86.68 v149.22,86.36
CS_C5_FRONT  (via drill 0.35)
  Top 0.254: v84.14,87 84.14,80.01 MCU2.37 | v149.86,87.31 150.18,87 150.18,80.01 MCU3.37
  Bottom 0.254: v84.14,87 85.09,87.95 122.56,87.95 123.19,87.31 v149.86,87.31
CS_C5_REAR  (via drill 0.35)
  Top 0.254: v87,74.93 87,77.47 MCU2.38 | MCU3.38 147.7,77.22 v144.78,74.3
  Bottom 0.254: v87,74.93 87.31,74.61 109.54,74.61 111.12,76.2 125.73,76.2 127.64,74.3 v144.78,74.3
CS_GYRO  (via drill 0.35)
  Top 0.254: v69.85,47.31 69.85,76.2 70.48,76.83 70.48,77.79 69.85,78.42 69.85,79.38 69.22,80.01 MCU2.25 | v77.79,46.67 82.23,42.23 v82.23,40.32 | v108.9,37.78 v108.9,40.32
  Bottom 0.254: v69.85,47.31 70.48,46.67 v77.79,46.67 | v82.23,40.32 82.55,40.64 104.14,40.64 104.46,40.32 v108.9,40.32 | v108.9,37.78 111.12,35.56 120.97,35.56 121.28,35.24 156.53,35.24 169.86,48.58 173.67,48.58 173.67,78.42 167,78.42 165.67,79.76 MCU3.25
CS_MOUSE  (via drill 0.35)
  Top 0.254: v80.64,83.19 80.64,78.74 79.38,77.47 MCU2.32
  Bottom 0.254: v80.64,83.19 80.96,83.5 87.63,83.5 88.9,84.77 120.97,84.77 122.24,83.5 150.5,83.5 151.45,82.55 156.84,82.55 159.38,80.01 159.38,79.38 158.43,78.42 156.66,78.42 MCU3.32
CS_SD  (via drill 0.35)
  Top 0.254: v81.92,85.09 81.92,80.01 MCU2.35 | v152.4,85.41 152.72,85.09 152.72,80.01 MCU3.35
  Bottom 0.254: v81.92,85.09 82.87,86.04 87.31,86.04 87.95,86.68 121.92,86.68 123.19,85.41 v152.4,85.41
D_36  (via drill 0.35)
  Top 0.254: v39.05,31.75 39.05,35.88 37.78,37.15 37.78,60.33 33.02,65.09 33.02,77.47 MEGA_EXPANSION.20
  Bottom 0.254: v39.05,31.75 44.77,26.04 50.16,26.04 51.75,24.45 62.55,24.45 62.87,24.13 69.22,24.13 U2.15
DAC_SS  (via drill 0.35)
  Top 0.254: v25.72,65.09 29.21,61.59 IC3_4802.2 | v20.32,67.94 18.73,69.53 18.73,76.52 MEGA_EXPANSION.8
  Bottom 0.254: v25.72,65.09 22.86,67.94 v20.32,67.94
DACA  (via drill 0.35)
  Top 0.254: v15.24,68.58 13.97,69.85 R24.1
  Bottom 0.254: v15.24,68.58 15.56,68.9 26.48,68.9 IC3_4802.8
DACB
  Top 0.254: R22.1 42.23,69.85 36.51,75.56 36.51,78.42 35.88,79.06 31.43,79.06 31.43,69.53 31.75,69.22 IC3_4802.6
DEBUG_LED
  Top 0.254: DIGITAL_8-13.6 52.96,12.95 41.27,1.27 30.23,1.27 DEBUG.A
DRDY_C  (via drill 0.35)
  Top 0.254: v74.3,70.48 74.3,72.07 72.39,73.98 72.39,76.83 71.75,77.47 MCU2.26 | v90.81,70.48 92.39,70.48 92.39,70.8 93.34,71.75 97.16,71.75 v97.16,70.8
  Bottom 0.254: v90.81,70.48 v74.3,70.48 | v97.16,70.8 105.41,70.8 108.27,73.66 120.97,73.66 121.28,73.34 159.07,73.34 162.94,77.22 MCU3.26
DRDY_G  (via drill 0.35)
  Top 0.254: v75.88,44.13 73.98,46.04 73.98,63.5 75.25,64.77 75.25,72.07 73.03,74.3 73.03,78.74 71.12,78.74 70.48,79.38 70.48,81.28 68.58,81.28 67.94,80.64 67.94,79.38 68.58,78.74 68.58,77.79 68.9,77.47 MCU2.24 | v85.41,43.18 87,41.59 v87,35.24 | v149.86,32.7 165.42,48.26 165.42,77.03 MCU3.24
  Bottom 0.254: v75.88,44.13 76.83,43.18 v85.41,43.18 | v87,35.24 88.58,33.66 110.49,33.66 111.44,32.7 v149.86,32.7
EBIKECONTRL  (via drill 0.35)
  Top 0.254: v117.47,44.77 117.16,45.09 117.16,74.93 110.81,81.28 95.89,81.28 95.89,79.69 94.93,78.74 93.34,78.74 93.34,77.15 91.12,74.93 88.58,74.93 88.58,73.03 v87,71.44
  Bottom 0.254: v117.47,44.77 112.71,44.77 112.39,44.45 MCU2.A4 | v87,71.44 72.39,71.44 72.07,71.75 54.93,71.75 54.61,72.07 6.99,72.07 5.02,70.1 ADCH.3
EN
  Bottom 0.254: MCU2.31 76.83,80.01 78.11,81.28 88.9,81.28 91.12,83.5 120.33,83.5 121.6,82.23 149.86,82.23 151.13,80.96 155.89,80.96 156.84,80.01 157.73,80.01 MCU3.31
ESTOP_INT  (via drill 0.35)
  Top 0.254: v95.25,20.32 87.95,13.02 87.95,9.53 v82.23,3.81 | v114.94,21.59 114.94,57.02 MCU2.A9
  Bottom 0.254: v114.94,21.59 113.67,20.32 v95.25,20.32 | v82.23,3.81 54.61,3.81 54.29,4.13 16.19,4.13 14.29,2.22 6.35,2.22 4.76,3.81 4.76,13.34 2.22,15.88 2.22,52.39 6.99,57.15 6.99,57.78 ADCH.7
FIX  (via drill 0.35)
  Top 0.254: v78.11,82.23 78.11,78.74 76.83,77.47 MCU2.30 | v156.53,81.6 156.84,81.28 156.84,78.42 157.8,77.47 MCU3.30
  Bottom 0.254: v78.11,82.23 88.9,82.23 90.81,84.14 120.65,84.14 121.92,82.87 150.18,82.87 151.45,81.6 v156.53,81.6
FWDSW  (via drill 0.35)
  Top 0.254: MEGA_EXPANSION.22 35.88,77.15 35.88,64.14 43.5,56.52 43.5,33.02 45.72,30.8 v45.72,25.08
  Bottom 0.254: v45.72,25.08 47.94,22.86 50.8,22.86 51.75,21.91 62.55,21.91 62.87,21.59 69.22,21.59 U2.16
GND  (via drill 0.35)
  Top 0.254: X1.1 46.04,12.38 46.04,20.64 46.99,21.59 IC2.1 46.99,21.91 44.77,24.13 44.77,30.8 41.27,34.29 PC2.- 40.96,34.61 40.96,42.23 PC1.- 40.96,42.55 40.96,54.29 39.37,55.88 C11.2 38.42,56.71 38.42,60.64 34.29,64.77 IC3_4802.5 | R25.2 16.51,63.82 16.51,51.44 C2.2 12.06,46.99 12.06,43.81 11.75,43.5 11.75,18.48 ICSP.6 | POWER.4 4.76,24.45 4.76,26.67 POWER.5 | 22.54,11.43 21.27,10.16 | 21.27,10.16 20,8.89 R12.1 | 22.54,11.43 26.35,11.43 R5.1 | 21.27,10.16 21.27,1.59 9.21,1.59 6.99,3.81 J1.2 | 30.8,38.42 30.8,45.72 C8.2 31.11,46.23 C12.2 31.11,52.39 30.8,52.7 30.8,60.01 30.48,60.33 30.48,66.67 29.21,67.94 IC3_4802.7 29.21,70.8 v26.99,73.03 | 30.8,38.42 30.8,35.56 30.48,35.24 C7.2 | MEGA_EXPANSION.2 9.84,77.79 9.84,80.01 MEGA_EXPANSION.1 | v44.45,65.41 44.45,64.45 45.09,63.82 R23.2 | 22.54,11.43 22.23,11.75 22.23,38.91 D4.3 | 134.3,20 134.3,27.62 132.08,29.84 IC1.1 | 134.3,20 134.3,13.02 133.99,12.7 C14.2 | MCU2.GND_1 112.39,24.13 112.39,26.67 MCU2.GND_2 | MCU3.GND_2 122.56,26.35 122.56,24.13 MCU3.GND_1 122.24,23.81 120.33,21.91 120.33,20 134.3,20 | U1.20 93.98,47.31 95.25,46.04 v95.25,32.7 95.25,21.59 v87.95,14.29 | C6.2 161.93,16.51 161.93,9.84 C5.2 162.24,9.84 170.5,9.84 MCU3.GND1 | 150.5,13.97 150.5,11.43 IC1_2515.4 | 150.5,13.97 150.5,16.51 IC1_2515.6 150.18,16.51 148.91,17.78 148.91,22.86 150.18,24.13 | 150.5,13.97 IC1_2515.5 | 150.18,24.13 150.18,28.26 C13.2 143.83,34.6 143.83,47.82 MCU3.5V_ICSP 145.41,49.53 145.41,54.61 | 150.18,24.13 IC1_2515.9 | MCU2.GND_A 107.31,77.47 107.31,80.01 MCU2.GND_B | MCU3.GND_B 127.64,79.69 127.64,77.47 MCU3.GND_A 142.56,62.17 142.56,57.47 145.41,54.61
  Top 0.254: 145.41,54.61 145.41,56.2 | 145.41,56.2 145.41,57.15 146.69,58.42 R9.2 | 145.41,56.2 157.16,56.2 157.8,56.83 157.8,66.99 161.29,66.99 162.24,66.04 162.24,65.41 160.34,63.5 IC2_2551.2 | 30.8,38.42 23.13,38.42 D4.3 | C10.2 22.54,55.94 22.54,39.22 D4.3
  Bottom 0.254: X1.3 41.27,9.53 43.81,12.06 45.72,12.06 X1.1 46.04,12.06 51.44,12.06 DIGITAL_8-13.7 53.34,10.16 MCU2.GND1 64.14,10.16 64.45,10.48 68.26,10.48 69.22,11.43 U2.20 69.53,11.43 70.48,10.48 81.28,10.48 81.6,10.16 83.82,10.16 v87.95,14.29 | 6.99,20.64 3.49,20.64 2.86,21.27 2.86,24.13 4.76,24.13 POWER.4 | 6.99,20.64 9.53,20.64 12.06,18.1 ICSP.6 | v44.45,65.41 40.96,68.9 34.29,68.9 IC3_4802.5 34.29,69.22 32.7,70.8 30.8,70.8 29.21,69.22 IC3_4802.7 | MEGA_EXPANSION.2 14.61,73.03 v26.99,73.03 | 6.99,20.64 6.99,18.1 3.49,18.1 2.86,17.46 2.86,16.19 6.67,12.38 6.67,3.94 J1.2 | MCU2.5V_ICSP 89.53,49.53 90.17,48.9 92.39,48.9 93.66,47.62 U1.20 | v95.25,32.7 101.28,26.67 MCU2.GND_2 | MCU2.GND_B 127.32,80.01 MCU3.GND_B | IC1_2515.9 150.18,24.13 148.59,25.72 123.19,25.72 122.49,26.42 MCU3.GND_2 | MCU3.GND_1 122.17,24.13 MCU2.GND_1 | IC1_2515.5 166.62,13.97 MCU3.GND1
GPS_RX  (via drill 0.35)
  Top 0.254: v85.41,52.39 89.85,56.83 89.85,70.8 91.44,72.39 98.11,72.39 98.11,57.15 99.69,55.56 v99.69,49.21
  Bottom 0.254: v85.41,52.39 64.45,52.39 64.14,52.07 MCU2.TX3 | v99.69,49.21 102.87,46.04 107.31,46.04 110.17,48.9 110.17,50.8 118.75,50.8 120.97,53.02 169.48,53.02 MCU3.TX3
GPS_TX  (via drill 0.35)
  Top 0.254: v60.96,79.69 60.96,57.47 63.82,54.61 MCU2.RX3 | v73.66,82.55 80.33,89.22 122.56,89.22 v122.56,79.06 | v140.97,78.42 141.6,77.79 141.6,72.07 151.76,61.91 156.84,61.91 v156.84,57.15
  Bottom 0.254: v60.96,79.69 63.82,82.55 v73.66,82.55 | v122.56,79.06 123.19,78.42 v140.97,78.42 | v156.84,57.15 159.38,54.61 170.43,54.61 MCU3.RX3
HALLPHASEA  (via drill 0.35)
  Top 0.254: MCU2.A6 108.9,49.53 108.9,41.59 107.63,40.32 v107.63,38.1 | v94.3,35.24 93.34,34.29 93.34,20.95 v80.96,8.57 | v9.21,14.61 6.99,16.83 6.99,73.03 ADCH.1
  Bottom 0.254: v107.63,38.1 104.78,35.24 v94.3,35.24 | v80.96,8.57 65.72,8.57 65.41,8.89 56.52,8.89 54.29,6.67 42.55,6.67 42.23,6.35 17.46,6.35 v9.21,14.61
HALLPHASEB  (via drill 0.35)
  Top 0.254: v111.12,78.74 114.94,74.93 114.94,66.04 111.12,66.04 110.17,65.09 110.17,56.83 114.3,52.7 114.3,48.9 112.39,46.99 MCU2.A5
  Bottom 0.254: v111.12,78.74 56.52,78.74 53.66,81.6 9.53,81.6 6.99,79.06 6.99,72.71 5.08,72.71 ADCH.2
HALLPHASEC  (via drill 0.35)
  Top 0.254: v86.36,67.94 87.95,69.53 87.95,71.44 89.22,72.71 89.22,74.3 93.03,74.3 95.89,77.15 95.89,78.74 97.47,78.74 98.42,77.79 98.42,76.83 98.74,76.52 98.74,71.44 100.65,69.53 100.65,44.13 105.73,39.05 105.73,18.41 107,18.41 107.63,19.05 107.63,26.99 114.3,33.66 114.3,39.88 MCU2.A3 | v68.26,67.63 66.99,68.9 66.99,75.25 65.41,76.83 65.41,83.82 59.37,89.85 16.83,89.85 2.86,75.88 2.86,69.53 ADCH.4
  Bottom 0.254: v86.36,67.94 86.04,67.63 v68.26,67.63
HIN_ROUT  (via drill 0.35)
  Top 0.254: v84.45,42.23 84.45,46.99 MCU2.MISO_ICSP
  Bottom 0.254: MCU3.MISO_ICSP 150.24,46.74 148.27,44.77 140.65,44.77 136.21,40.32 121.28,40.32 120.97,40.64 110.81,40.64 109.22,42.23 v84.45,42.23
HL_+3V3
  Bottom 0.508: 88.11,17.62 82.23,11.75 U2.10 | 88.11,17.62 88.27,17.78 121.28,17.78 122.3,18.8 MCU3.3V3 | 88.11,17.62 87.95,17.78 87.95,28.57 82.16,34.36 U2.1
HL_+5V  (via drill 0.35)
  Top 0.508: MCU3.5V_A 170.81,77.47 170.81,79.69 MCU3.5V_B | v136.84,38.73 127.64,29.53 127.64,21.59 122.56,21.59 MCU3.5V
  Bottom 0.508: v136.84,38.73 142.24,44.13 150.18,44.13 151.76,45.72 151.76,49.21 | 151.76,49.21 150.5,49.21 MCU3.GND_ICSP | 151.76,49.21 172.72,49.21 172.72,75.18 MCU3.5V_A
HOUT_RIN  (via drill 0.35)
  Top 0.254: v90.49,43.18 90.81,43.5 90.81,48.26 88.27,48.26 87,49.53 MCU2.MOSI_ICSP | v109.86,46.99 v109.86,42.86
  Bottom 0.254: v90.49,43.18 90.81,42.86 v109.86,42.86 | v109.86,46.99 111.12,48.26 118.75,48.26 120.97,50.48 144.46,50.48 144.78,50.8 146.3,50.8 MCU3.MOSI_ICSP
I1
  Top 0.254: MCU3.27 162.88,80.01 161.93,80.01 152.08,89.85 71.75,89.85 71.75,80.01 MCU2.27
I2
  Bottom 0.254: MCU2.28 74.3,77.47 75.88,75.88 95.25,75.88 95.89,75.25 109.22,75.25 110.81,76.83 126.05,76.83 127.64,75.25 158.75,75.25 160.66,77.15 MCU3.28
INT1  (via drill 0.35)
  Top 0.254: v68.9,61.91 69.22,62.23 69.22,67.94 67.94,69.22 67.94,77.79 67.31,78.42 67.31,79.38 66.67,80.01 MCU2.23 | v77.79,60.96 82.87,55.88 82.87,40.96 v84.77,39.05 | v156.21,37.78 167,48.58 167,78.61 MCU3.23
  Bottom 0.254: v68.9,61.91 69.85,60.96 v77.79,60.96 | v84.77,39.05 107.95,39.05 108.27,38.73 109.22,38.73 109.86,38.1 120.97,38.1 121.28,37.78 v156.21,37.78
J_VIN  (via drill 0.35)
  Top 0.508: v68.58,49.85 68.9,49.53 v68.9,38.1 | v99.69,38.1 105.09,32.7 105.09,18.1 105.41,17.78 110.17,17.78 110.17,27.11 MCU2.VIN
  Bottom 0.508: v68.58,49.85 47.31,49.85 JP1.1 | v99.69,38.1 v68.9,38.1
L_SENSE  (via drill 0.35)
  Top 0.254: v105.73,73.66 113.67,73.66 114.3,73.03 114.3,69.22 112.39,67.31 MCU2.DAC0 | v48.58,73.66 46.67,71.75 v46.67,55.24
  Bottom 0.254: v105.73,73.66 105.41,73.98 66.67,73.98 66.36,74.3 65.09,74.3 64.45,73.66 v48.58,73.66 | v46.67,55.24 41.59,50.16 15.56,50.16 5.08,39.69 ADCL.6
LED  (via drill 0.35)
  Top 0.254: v83.19,85.09 83.19,78.74 81.92,77.47 MCU2.34 | v151.76,84.45 151.76,78.42 152.72,77.47 MCU3.34
  Bottom 0.254: v83.19,85.09 83.5,85.41 87.63,85.41 88.27,86.04 121.6,86.04 122.87,84.77 151.45,84.77 v151.76,84.45
LL_+5V  (via drill 0.35)
  Top 0.508: MEGA_EXPANSION.35 53.02,80.01 53.02,77.79 MEGA_EXPANSION.36 53.09,77.53 49.53,73.98 v49.53,21.91 | v16.83,21.27 17.14,20.95 17.14,18.1 ICSP.2
  Bottom 0.508: POWER.3 5.4,21.27 v16.83,21.27 17.46,21.91 v49.53,21.91
LL_SCK  (via drill 0.35)
  Top 0.254: MEGA_EXPANSION.4 12.38,77.47 v12.38,63.18 10.16,60.96 10.16,16.83 13.34,16.83 14.67,15.49 ICSP.3 | v83.82,34.29 83.5,34.61 83.5,36.2 v80.33,39.37 | v34.29,38.42 32.38,40.32 32.38,60.64 31.75,61.28 IC3_4802.3
  Bottom 0.254: v83.82,34.29 95.25,22.86 113.67,22.86 113.98,22.54 136.53,22.54 142.56,16.51 IC1_2515.13 | v80.33,39.37 80.01,39.05 66.36,39.05 65.41,38.1 54.61,38.1 54.29,38.42 v34.29,38.42 | v12.38,63.18 30.04,63.18 IC3_4802.3
MISO  (via drill 0.35)
  Top 0.254: v9.21,16.83 9.53,17.14 9.53,75.56 11.11,77.15 11.11,78.11 12.06,79.06 13.65,79.06 MEGA_EXPANSION.6 | v92.39,12.7 80.96,1.27 55.56,1.27 v55.56,15.56
  Bottom 0.254: v9.21,16.83 15.88,16.83 17.14,15.56 ICSP.1 17.4,15.49 20,18.1 42.23,18.1 43.5,16.83 54.29,16.83 v55.56,15.56 | v92.39,12.7 113.35,12.7 115.57,14.92 139.06,14.92 142.56,11.43 IC1_2515.15
MOSI  (via drill 0.35)
  Top 0.254: v23.18,20.95 35.88,33.66 35.88,39.05 34.29,40.64 IC3_4802.4 | MEGA_EXPANSION.5 16.19,79.06 16.19,72.71 18.1,70.8 18.1,42.23 17.14,41.27 17.14,38.42 14.92,36.2 14.92,18.22 ICSP.4 | v65.72,11.43 v69.85,7.3
  Bottom 0.254: 21.59,19.37 v23.18,20.95 | 21.59,19.37 16.19,19.37 14.92,18.1 ICSP.4 | v69.85,7.3 111.76,7.3 112.71,8.26 121.92,8.26 123.83,10.16 144.15,10.16 144.15,12.57 IC1_2515.14 | v65.72,11.43 62.23,11.43 54.29,19.37 21.59,19.37
N$4
  Top 0.254: 130.81,10.16 130.81,3.81 R14.2 | 130.81,10.16 130.81,12.7 C14.1 | 130.81,10.16 137.16,3.81 R13.2
N$9  (via drill 0.35)
  Top 0.254: v14.29,36.83 13.34,35.88 13.34,35.24 R8.1 | v23.18,35.24 27.37,35.24 C7.1
  Bottom 0.254: v23.18,35.24 21.59,36.83 v14.29,36.83
N$10  (via drill 0.35)
  Top 0.254: v25.72,45.72 27.94,45.72 C8.1 | v14.61,43.81 13.34,42.55 R7.1
  Bottom 0.254: v25.72,45.72 23.81,43.81 v14.61,43.81
N$12
  Top 0.254: R12.2 22.86,8.89 22.86,2.86 POWER_OK.K
N$13
  Top 0.254: DEBUG.K 29.36,4.67 R5.2
N$14
  Top 0.254: IC2_2551.8 152.59,60.64 146.05,60.64 144.08,58.67 R9.1
NPD  (via drill 0.35)
  Top 0.254: v79.38,83.19 79.38,80.01 MCU2.33 | v155.57,83.5 155.57,80.01 MCU3.33
  Bottom 0.254: v79.38,83.19 80.33,84.14 87.31,84.14 88.58,85.41 121.28,85.41 122.56,84.14 150.81,84.14 151.45,83.5 v155.57,83.5
OSC1
  Top 0.254: Q1.2 160.66,30.16 159.38,28.89 159.38,16.83 C6.1 154.3,21.59 IC1_2515.8
OSC2
  Top 0.254: C5.1 159.07,9.84 159.07,10.48 150.5,19.05 IC1_2515.7
  Bottom 0.254: IC1_2515.7 151.76,19.05 160.68,27.96 Q1.1
PPS  (via drill 0.35)
  Top 0.254: v77.15,84.45 77.15,82.87 74.3,80.01 MCU2.29 | v82.87,87 83.82,87.95 91.44,87.95 v91.44,82.55
  Bottom 0.254: v77.15,84.45 79.69,87 v82.87,87 | v91.44,82.55 92.08,81.92 120.97,81.92 121.28,81.6 147.64,81.6 149.22,80.01 149.22,75.88 158.43,75.88 159.38,76.83 159.38,78.42 160.53,79.57 MCU3.29
PWRIN
  Top 0.254: D1.A 30.9,19.05 37.16,19.05 X1.2
R_+3V3  (via drill 0.35)
  Top 0.508: v106.68,19.37 106.68,47.31 U1.10 107,47.62 108.27,48.9 108.27,68.9 107,70.17 U1.1
  Bottom 0.508: v106.68,19.37 111.76,19.37 112.08,19.05 MCU2.3V3
R_+5V  (via drill 0.35)
  Top 0.508: 64.14,77.47 64.14,80.01 MCU2.5V_B | v92.39,22.23 91.44,23.18 91.44,49.53 89.85,51.12 84.45,51.12 | 84.45,51.12 84.45,49.53 MCU2.GND_ICSP | 64.14,77.47 64.45,77.15 v64.45,74.93 | 84.45,51.12 v84.45,74.93 | 64.14,77.47 MCU2.5V_A
  Bottom 0.508: v92.39,22.23 111.44,22.23 112.08,21.59 MCU2.5V | v84.45,74.93 v64.45,74.93
R_BRAKE_ON  (via drill 0.35)
  Top 0.254: v60.64,43.18 60.64,41.91 60.96,41.59 60.96,25.72 63.82,22.86 MCU2.9 | v87.95,44.77 87.95,34.61 85.41,32.07 82.23,32.07 U2.2
  Bottom 0.254: v60.64,43.18 73.66,43.18 75.56,45.09 87.63,45.09 v87.95,44.77
R_BRAKE_PWM  (via drill 0.35)
  Top 0.254: v104.78,41.27 105.41,41.91 105.41,56.2 106.68,57.47 U1.6
  Bottom 0.254: v104.78,41.27 64.77,41.27 64.14,41.91 MCU2.2
R_BUZZER  (via drill 0.35)
  Top 0.254: v66.99,42.23 64.14,39.37 MCU2.3 | v74.3,42.23 75.88,40.64 v75.88,33.02
  Bottom 0.254: v74.3,42.23 v66.99,42.23 | U2.4 81.99,26.92 v75.88,33.02
R_D_36  (via drill 0.35)
  Top 0.254: v67.31,36.51 67.31,35.56 62.87,35.56 61.91,34.61 61.91,31.11 63.82,29.21 MCU2.7 | v76.83,37.15 77.47,36.51 77.47,29.07 U2.5
  Bottom 0.254: v67.31,36.51 67.94,37.15 v76.83,37.15
R_DACA  (via drill 0.35)
  Top 0.254: R25.1 13.97,64.14 v16.51,66.67 16.51,69.85 R24.2 | v109.86,39.37 109.86,39.05 112.08,36.83 MCU2.A1 | v81.6,39.37 76.83,44.13 v76.83,62.55
  Bottom 0.254: v109.86,39.37 108.58,39.37 108.27,39.69 85.41,39.69 85.09,40.01 83.19,40.01 82.55,39.37 v81.6,39.37 | v76.83,62.55 75.25,64.14 66.04,64.14 65.41,63.5 54.61,63.5 54.29,63.82 19.37,63.82 v16.51,66.67
R_DACB  (via drill 0.35)
  Top 0.254: 44.13,68.9 45.09,69.85 R22.2 | 44.13,68.9 43.5,68.26 43.5,64.77 42.55,63.82 R23.1 | v92.71,35.24 92.08,35.88 92.08,52.7 v90.81,53.98 | v55.56,55.88 56.83,57.15 56.83,83.82 59.37,86.36 44.13,86.36 44.13,68.9
  Bottom 0.254: MCU2.A0 93.66,34.29 v92.71,35.24 | v90.81,53.98 67.31,53.98 65.41,55.88 v55.56,55.88
R_FWDSW  (via drill 0.35)
  Top 0.254: v70.48,33.34 70.8,33.66 70.8,35.88 68.58,35.88 66.36,33.66 66.36,27.62 64.14,25.4 MCU2.8
  Bottom 0.254: U2.6 81.99,21.84 v70.48,33.34
R_REGEN_ACTIVE
  Top 0.254: MCU2.11 64.14,17.78 67.31,14.61 67.31,10.79 69.53,8.57 79.38,8.57 79.38,13.97 81.92,16.51 U2.8
R_REVERSE  (via drill 0.35)
  Top 0.254: v73.66,11.43 73.66,10.16 68.9,10.16 67.94,11.11 67.94,16.51 64.14,20.32 MCU2.10
  Bottom 0.254: v73.66,11.43 81.28,19.05 81.92,19.05 U2.7
R_RX1  (via drill 0.35)
  Top 0.254: v61.91,70.48 61.91,66.67 63.82,64.77 MCU2.RX1 | v99.69,71.75 103.19,68.26 v103.19,52.7
  Bottom 0.254: v61.91,70.48 62.55,71.12 71.75,71.12 73.34,69.53 91.12,69.53 93.34,71.75 v99.69,71.75 | v103.19,52.7 105.73,50.16 106.68,50.16 U1.9
R_RX3  (via drill 0.35)
  Top 0.254: MCU2.RX2 67.63,59.69 v67.63,61.91 | v74.93,63.18 82.55,70.8 82.55,74.3 84.45,76.2 85.72,76.2 85.72,78.11 86.36,78.74 90.49,78.74 90.49,79.38 90.81,79.69 90.81,80.64 92.71,82.55 92.71,83.82 93.03,84.14 119.06,84.14 v119.06,69.53
  Bottom 0.254: v67.63,61.91 68.9,63.18 v74.93,63.18 | v119.06,69.53 115.57,66.04 107.63,66.04 107,65.41 U1.3
R_SENSE  (via drill 0.35)
  Top 0.254: v118.11,71.44 117.79,71.75 117.79,75.25 109.54,83.5 93.34,83.5 93.34,79.69 92.39,78.74 91.44,78.74 90.81,78.11 90.81,77.15 89.22,75.56 87.95,75.56 87.95,73.66 85.41,71.12 v85.41,61.28
  Bottom 0.254: v118.11,71.44 113.98,71.44 112.39,69.85 MCU2.DAC1 | v85.41,61.28 82.55,58.42 56.52,58.42 54.29,56.2 19.05,56.2 5.02,42.16 ADCL.5
R_STEER_PWM  (via drill 0.35)
  Top 0.254: v59.05,32.38 59.05,42.86 v61.91,45.72
  Bottom 0.254: v59.05,32.38 63.18,32.38 63.82,31.75 MCU2.6 | v61.91,45.72 92.39,45.72 92.71,45.4 94.61,45.4 103.19,53.98 103.19,54.93 106.62,54.93 U1.7
R_TX1  (via drill 0.35)
  Top 0.254: v66.04,73.34 66.04,64.14 64.14,62.23 MCU2.TX1 | v102.23,71.75 104.14,69.85 v104.14,53.98
  Bottom 0.254: v66.04,73.34 100.65,73.34 v102.23,71.75 | v104.14,53.98 105.41,52.7 106.68,52.7 U1.8
R_TX3  (via drill 0.35)
  Top 0.254: v82.55,57.47 83.5,58.42 v83.5,72.39 | v103.19,69.53 v100.97,71.75
  Bottom 0.254: v83.5,72.39 83.82,72.71 100.01,72.71 v100.97,71.75 | v103.19,69.53 104.78,67.94 106.68,67.94 U1.2 | MCU2.TX2 64.14,57.15 64.45,57.47 v82.55,57.47
R_VOLTAGE_SWITCH  (via drill 0.35)
  Top 0.254: v67.31,40.01 64.14,36.83 MCU2.4 | U2.3 79.38,32.24 v79.38,40.01
  Bottom 0.254: v79.38,40.01 v67.31,40.01
R_WATCHDOG  (via drill 0.35)
  Top 0.254: v60.01,33.97 60.33,33.66 60.33,8.89 62.87,6.35 80.01,6.35 80.01,12.06 U2.9
  Bottom 0.254: v60.01,33.97 63.5,33.97 63.82,34.29 MCU2.5
REGEN_ACTIVE  (via drill 0.35)
  Top 0.254: v72.71,72.39 72.07,71.75 72.07,19.56 U2.18
  Bottom 0.254: MEGA_EXPANSION.34 49.21,79.06 47.62,79.06 46.67,78.11 46.67,72.71 65.41,72.71 65.72,72.39 v72.71,72.39
RESET
  Bottom 0.254: POWER.1 6.03,15.56 12.06,15.56 ICSP.5
REVERSE  (via drill 0.35)
  Top 0.254: v70.8,75.88 71.44,75.25 71.44,21.46 U2.17
  Bottom 0.254: MEGA_EXPANSION.32 49.85,75.88 v70.8,75.88
RS
  Top 0.254: R13.1 134.62,3.49 135.89,2.22 144.15,2.22 144.15,5.08 142.88,6.35 IC1_2515.17
RST  (via drill 0.35)
  Top 0.254: v89.53,44.77 89.53,46.99 MCU2.RESET_ICSP
  Bottom 0.254: v89.53,44.77 110.17,44.77 111.12,45.72 120.97,45.72 121.28,45.4 139.38,45.4 140.65,46.67 145.22,46.67 MCU3.RESET_ICSP
RX0  (via drill 0.35)
  Top 0.254: v56.83,50.8 53.34,47.31 DIGITAL_0-7.1
  Bottom 0.254: v56.83,50.8 93.03,50.8 93.8,50.03 U1.19
RX3  (via drill 0.35)
  Top 0.254: v92.08,53.98 92.39,54.29 92.39,63.82 93.66,65.09 U1.13
  Bottom 0.254: DIGITAL_14-21.7 54.61,53.34 90.17,53.34 90.49,53.02 91.12,53.02 v92.08,53.98
SCK  (via drill 0.35)
  Top 0.254: v87,44.13 87,46.99 MCU2.SCK_ICSP
  Bottom 0.254: v87,44.13 87.31,43.81 89.85,43.81 90.17,44.13 110.17,44.13 111.12,43.18 120.97,43.18 121.28,42.86 137.79,42.86 140.34,45.4 146.37,45.4 147.7,46.74 MCU3.SCK_ICSP
SCL1  (via drill 0.35)
  Top 0.254: v82.87,8.26 77.15,2.54 MCU2.SCL1 59.69,6.86 59.69,10.79 58.42,12.06 58.42,25.08 56.64,26.86 R1.2 | v111.44,8.26 117.79,14.61 117.79,25.4 119.13,26.73 R3.2
  Bottom 0.254: R3.2 120.97,25.08 134.94,25.08 142.24,17.78 144.78,17.78 149.86,12.7 165.42,12.7 169.54,8.57 172.09,8.57 172.72,7.94 172.72,4.32 MCU3.SCL1 | v111.44,8.26 v82.87,8.26
SDA1
  Bottom 0.254: R2.2 MCU2.SDA1 85.41,5.08 86.36,6.03 112.39,6.03 113.35,5.08 R4.2 119.38,5.08 121.92,7.62 167.89,7.62 MCU3.SDA1
SPEEDOMETER  (via drill 0.35)
  Top 0.254: MCU2.A11 115.57,64.77 115.57,75.56 111.44,79.69 109.22,79.69 v109.22,77.79 | v96.2,76.2 93.66,73.66 89.85,73.66 89.85,71.75 88.58,70.48 v88.58,66.67
  Bottom 0.254: v109.22,77.79 107.63,76.2 v96.2,76.2 | v88.58,66.67 81.92,60.01 66.36,60.01 65.41,60.96 54.61,60.96 54.29,61.28 36.51,61.28 34.92,59.69 10.16,59.69 ADCH.5
SPI_SS
  Bottom 0.254: MCU2.53 104.78,80.01 106.05,81.28 120.65,81.28 120.97,80.96 128.91,80.96 129.86,80.01 MCU3.53
STEER_SERVO_PWM  (via drill 0.35)
  Top 0.254: DIGITAL_0-7.7 51.12,33.97 v51.12,43.18 | v77.79,47.94 81.28,51.44 v81.28,54.93
  Bottom 0.254: v51.12,43.18 51.44,43.5 58.1,43.5 62.87,48.26 77.47,48.26 v77.79,47.94 | v81.28,54.93 93.66,54.93 U1.17
TX0
  Bottom 0.254: DIGITAL_0-7.2 53.28,44.7 57.47,48.9 83.19,48.9 83.82,48.26 91.12,48.26 93.34,46.04 94.3,46.04 95.25,46.99 95.25,51.23 U1.18
TX3  (via drill 0.35)
  Top 0.254: DIGITAL_14-21.8 51.12,54.29 51.12,63.18 51.75,63.82 55.88,63.82 v55.88,64.45
  Bottom 0.254: v55.88,64.45 57.47,66.04 86.04,66.04 87.63,67.63 93.66,67.63 U1.12
VIN  (via drill 0.35)
  Top 0.508: v11.11,44.13 11.11,47.62 13.02,49.53 C2.1 | v26.35,22.86 26.35,19.37 D1.C | v129.54,26.67 129.54,25.4 131.76,25.4 IC1.3 | JP1.2 44.77,49.53 45.72,48.58 45.72,42.55 PC1.+ 47.94,40.31 47.94,26.99 47.22,26.26 IC2.3 47.22,26.12 48.58,24.77 48.58,20.95 49.85,20.95 50.48,21.59 50.48,26.99 53.34,26.99 55.24,28.89 55.24,34.29 v56.52,35.56 | POWER.6 4.7,29.46 2.54,27.3 2.54,4.57 J1.1
  Bottom 0.508: 11.11,29.53 v11.11,44.13 16.51,49.53 44.45,49.53 JP1.2 | 11.11,29.53 5.08,29.53 POWER.6 | v26.35,22.86 19.68,29.53 11.11,29.53 | v129.54,26.67 127.32,28.89 122.56,28.89 MCU3.VIN 117.22,28.96 113.67,25.4 93.98,25.4 83.19,36.2 68.26,36.2 67.63,35.56 v56.52,35.56
VOLTAGE_SWITCH  (via drill 0.35)
  Top 0.254: v30.48,73.03 30.48,67.63 32.38,65.72 32.38,63.18 33.02,62.55 33.02,40.96 35.24,38.73 35.24,37.78 v34.92,37.47
  Bottom 0.254: v30.48,73.03 31.43,73.03 31.43,78.74 32.7,80.01 MEGA_EXPANSION.19 | v34.92,37.47 39.05,33.34 56.83,33.34 59.69,30.48 68.25,30.48 U2.13
WATCHDOG  (via drill 0.35)
  Top 0.254: v59.37,17.46 59.37,25.72 57.15,27.94 57.15,34.92 57.47,35.24 57.47,36.51 55.24,36.51 53.28,34.54 DIGITAL_0-7.6
  Bottom 0.254: v59.37,17.46 62.87,13.97 69.22,13.97 U2.19
WHEELROTATION  (via drill 0.35)
  Top 0.254: v78.11,83.5 83.19,88.58 120.02,88.58 v120.02,58.1
  Bottom 0.254: MCU2.A8 112.39,57.15 113.35,58.1 v120.02,58.1 160.02,58.1 167.96,66.04 167.96,77.03 MCU3.22 | ADCH.8 2.22,60.01 2.22,78.42 7.37,83.57 7.87,83.57 v78.11,83.5

### Text on the board
bNames: 53 | 51 | 49 | 47 | 45 | 43 | 41 | 39 | 37 | 35 | 33 | 31 | 29 | 27 | 25 | 23 | +5V | GND | A15 | 52 | 50 | 48 | 46 | 44 | 42 | 40 | 38 | 36 | 34 | 32 | 30 | 28 | 26 | 22 | 24 | A14 | A13 | 21 | A12 | 20 | A11 | 19 | A10 | 18 | A9 | 17 | A8 | 16 | 15 | A7 | 14 | A6 | A5 | 0 | A4 | 1 | A3 | 2 | A2 | 3 | A1 | 4 | A0 | 5 | 6 | VIN | 7 | GND | GND | 8 | 9 | 5V | 3V | GND | MOSI | 5V | 10 | 11 | RES | 12 | RST | SCK | MISO | 13 | GND | 15 | 16 | 17